# EAGLE schematic beaglebone_basic_v1.12 (EAGLE 5.11)
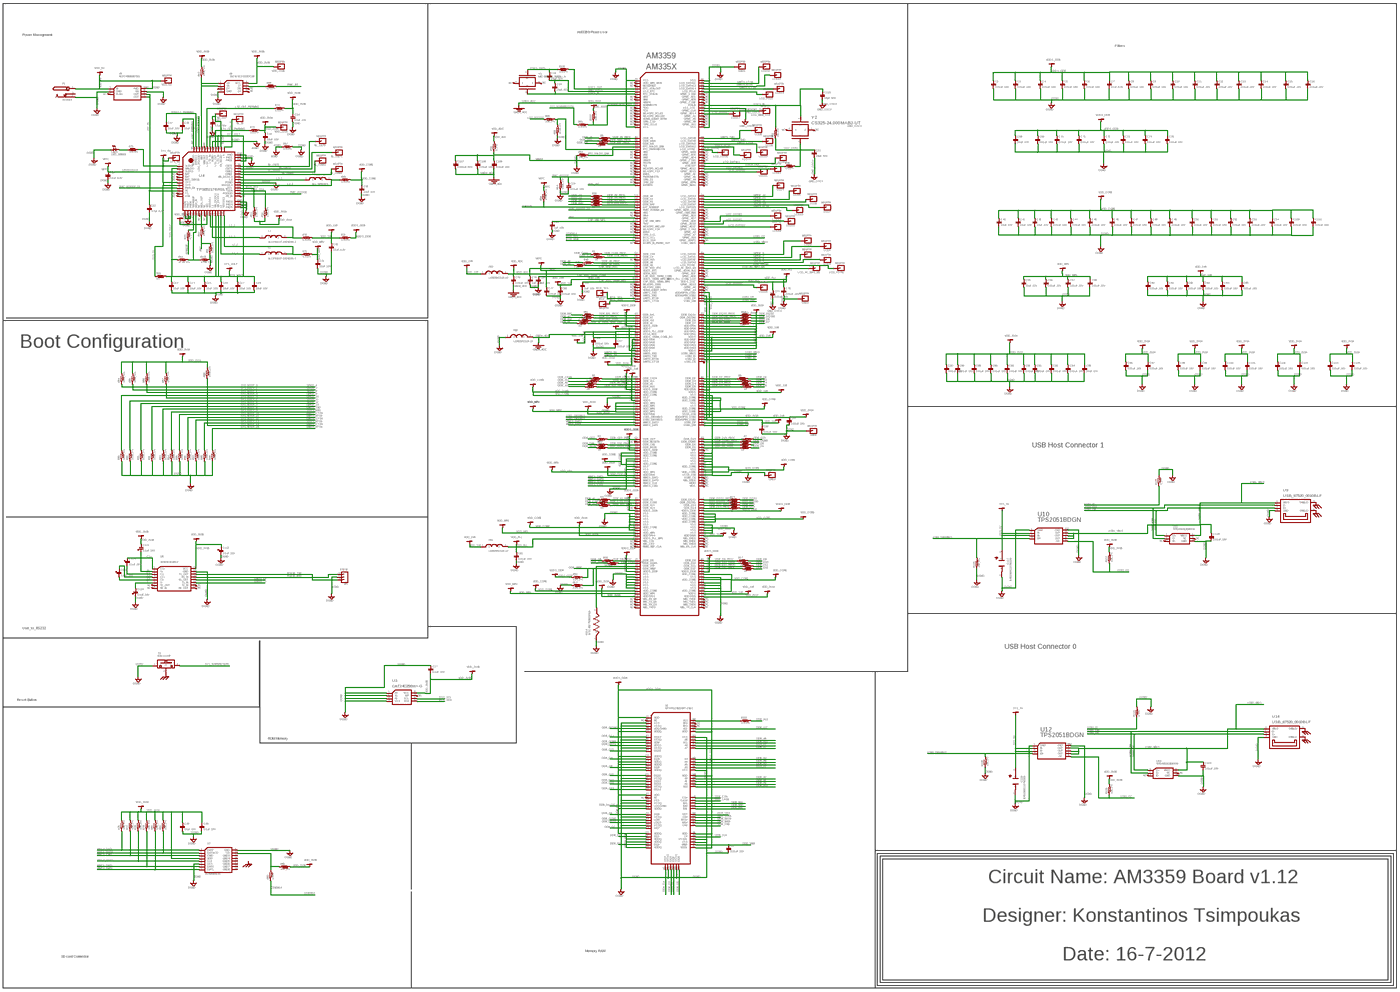
[diagram p0: schematic, sheet 1, overview]
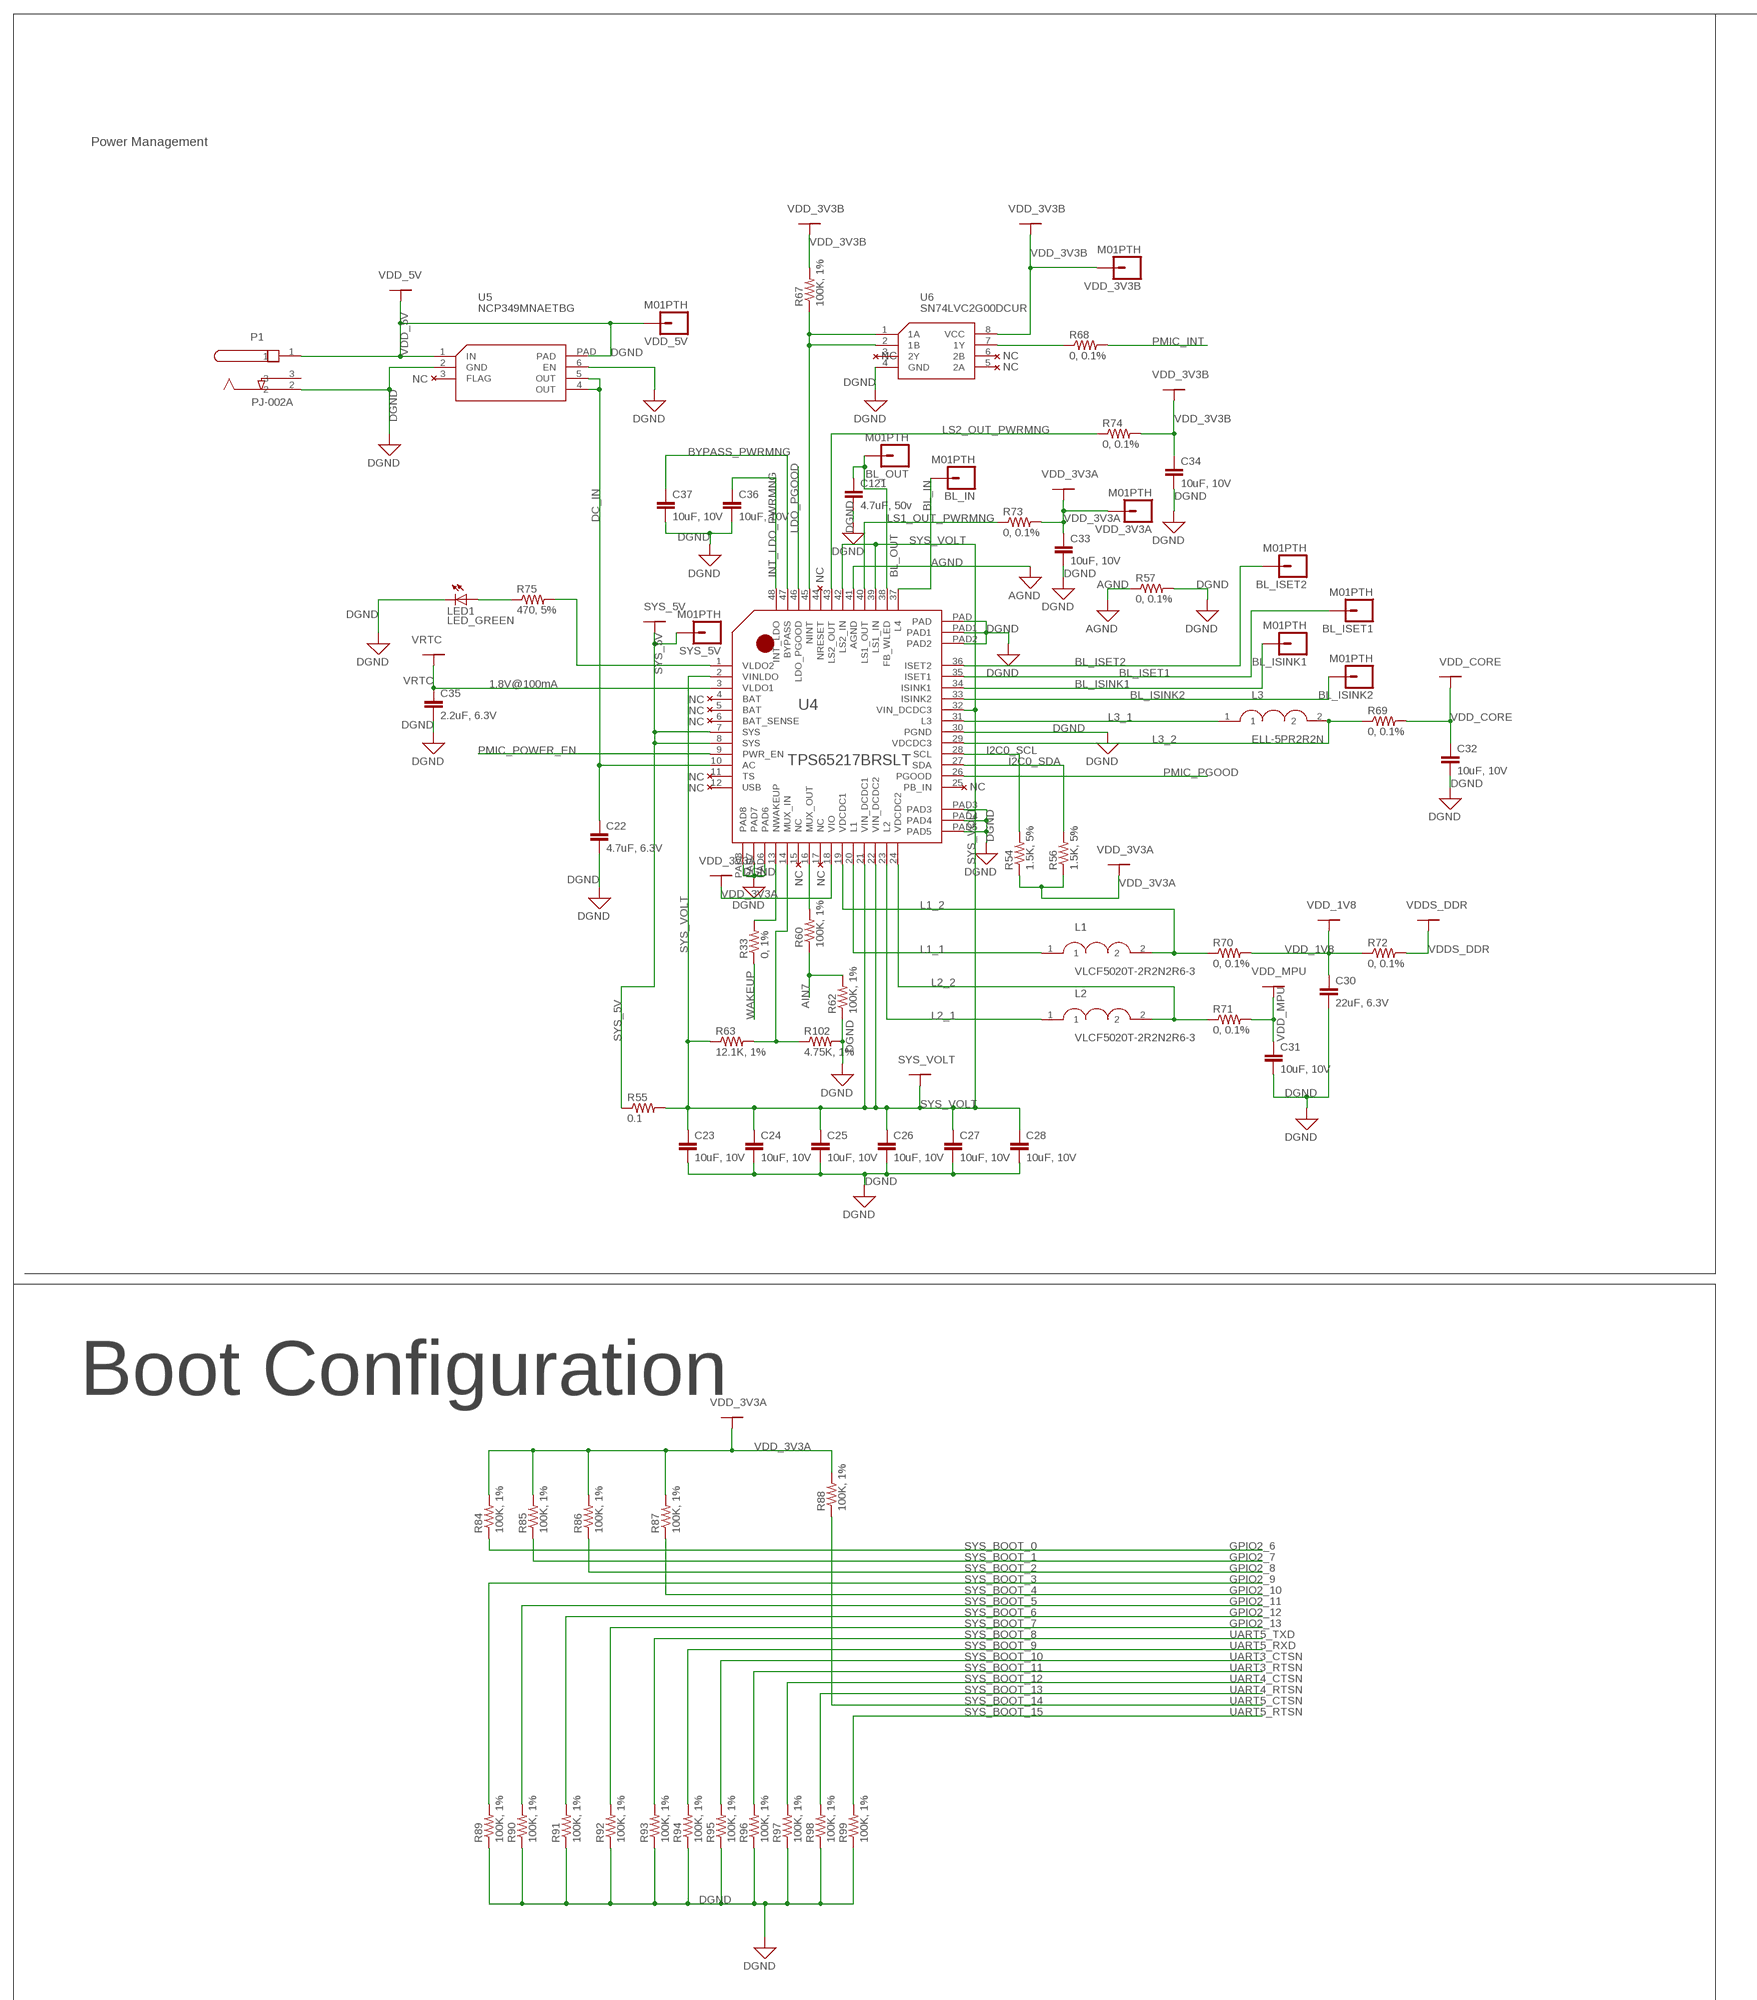
[diagram p1: schematic, sheet 1, part 1 of 6]
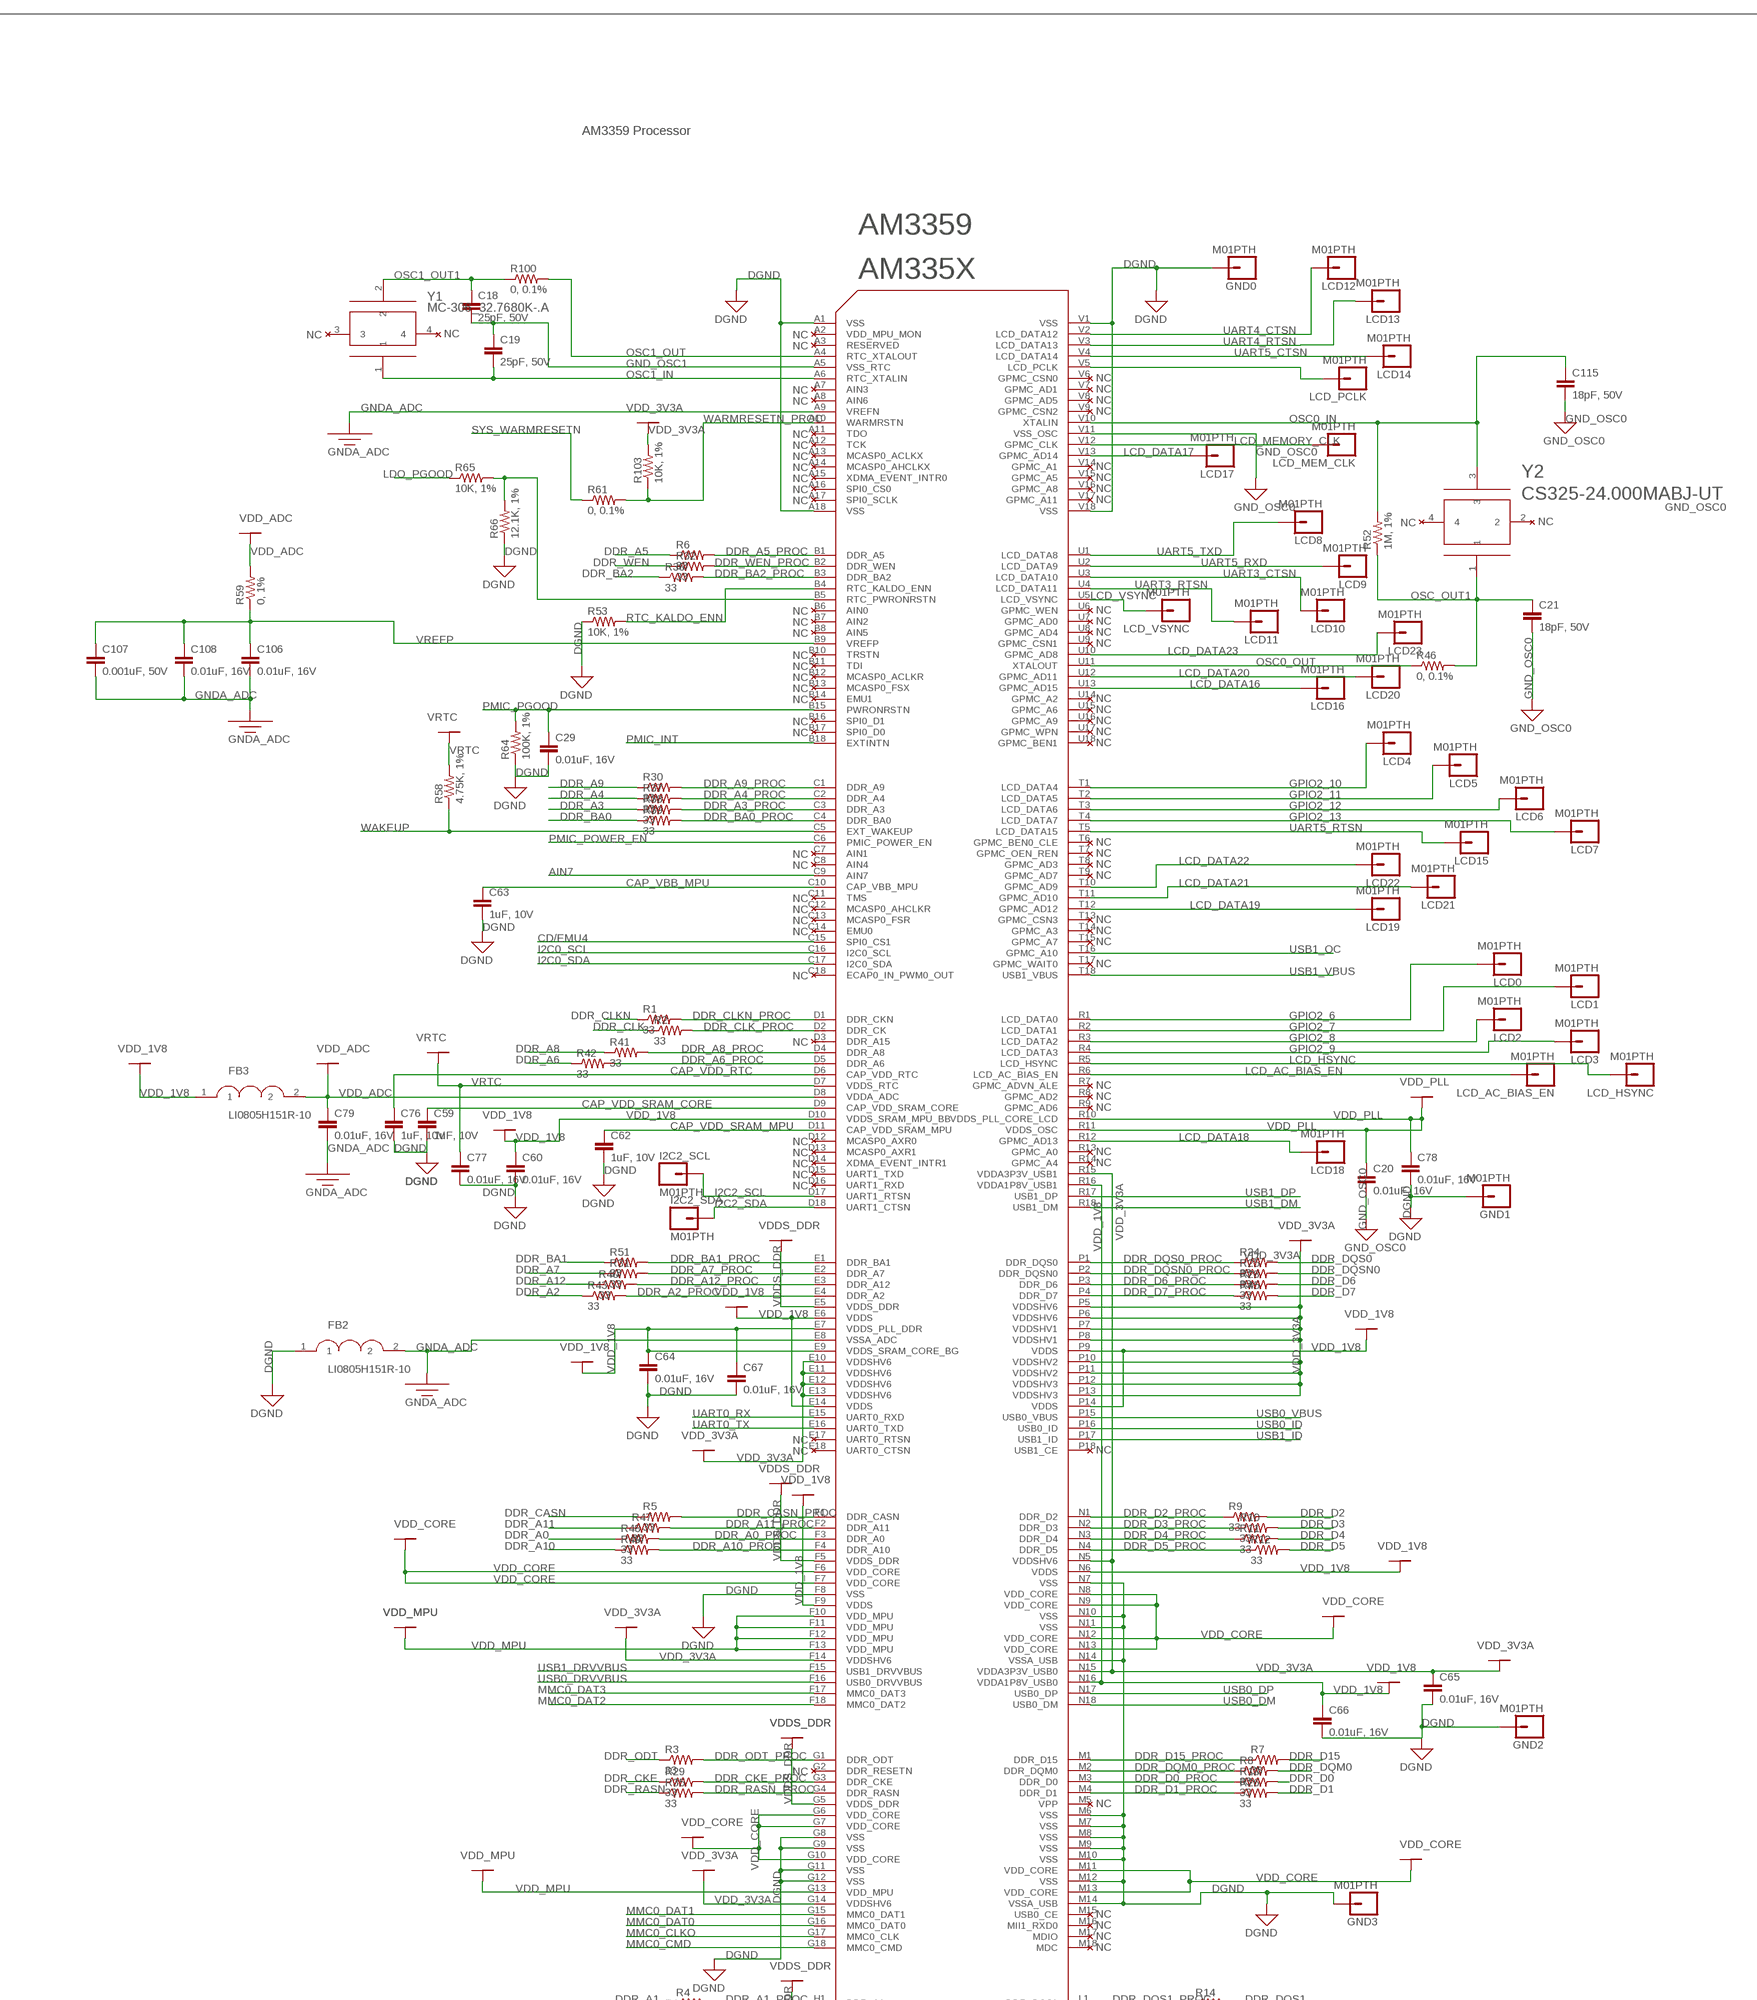
[diagram p2: schematic, sheet 1, part 2 of 6]
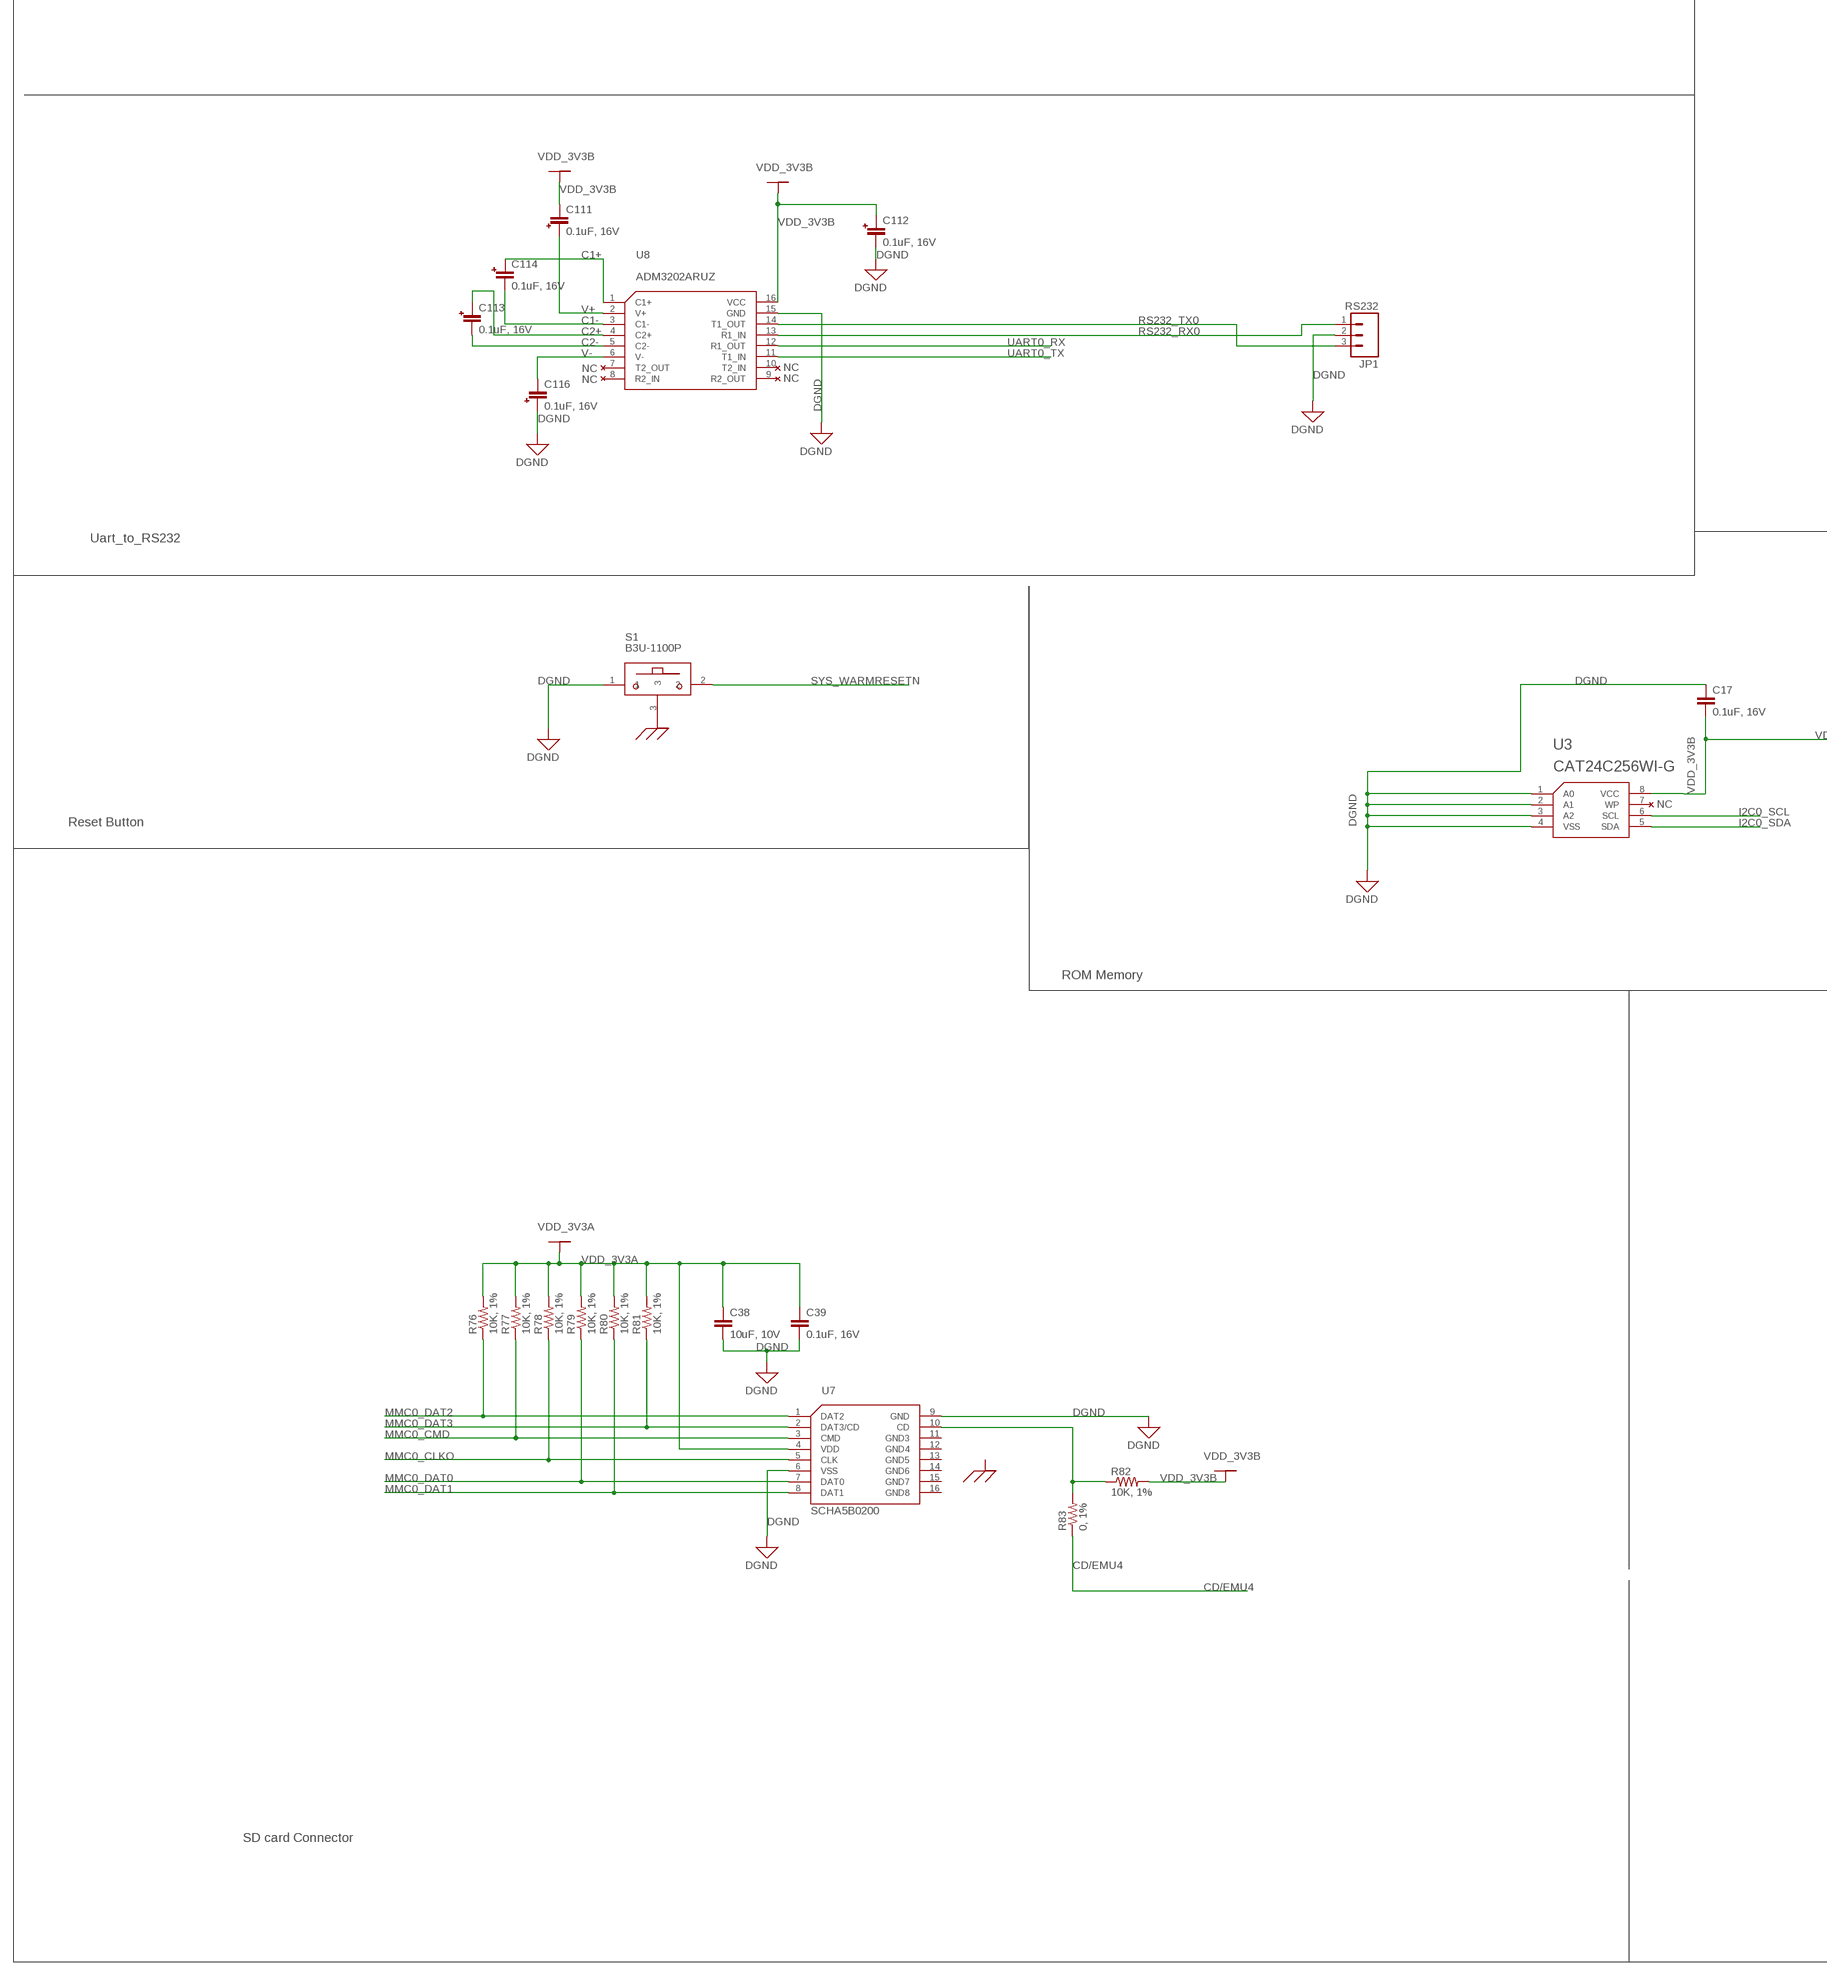
[diagram p3: schematic, sheet 1, part 3 of 6]
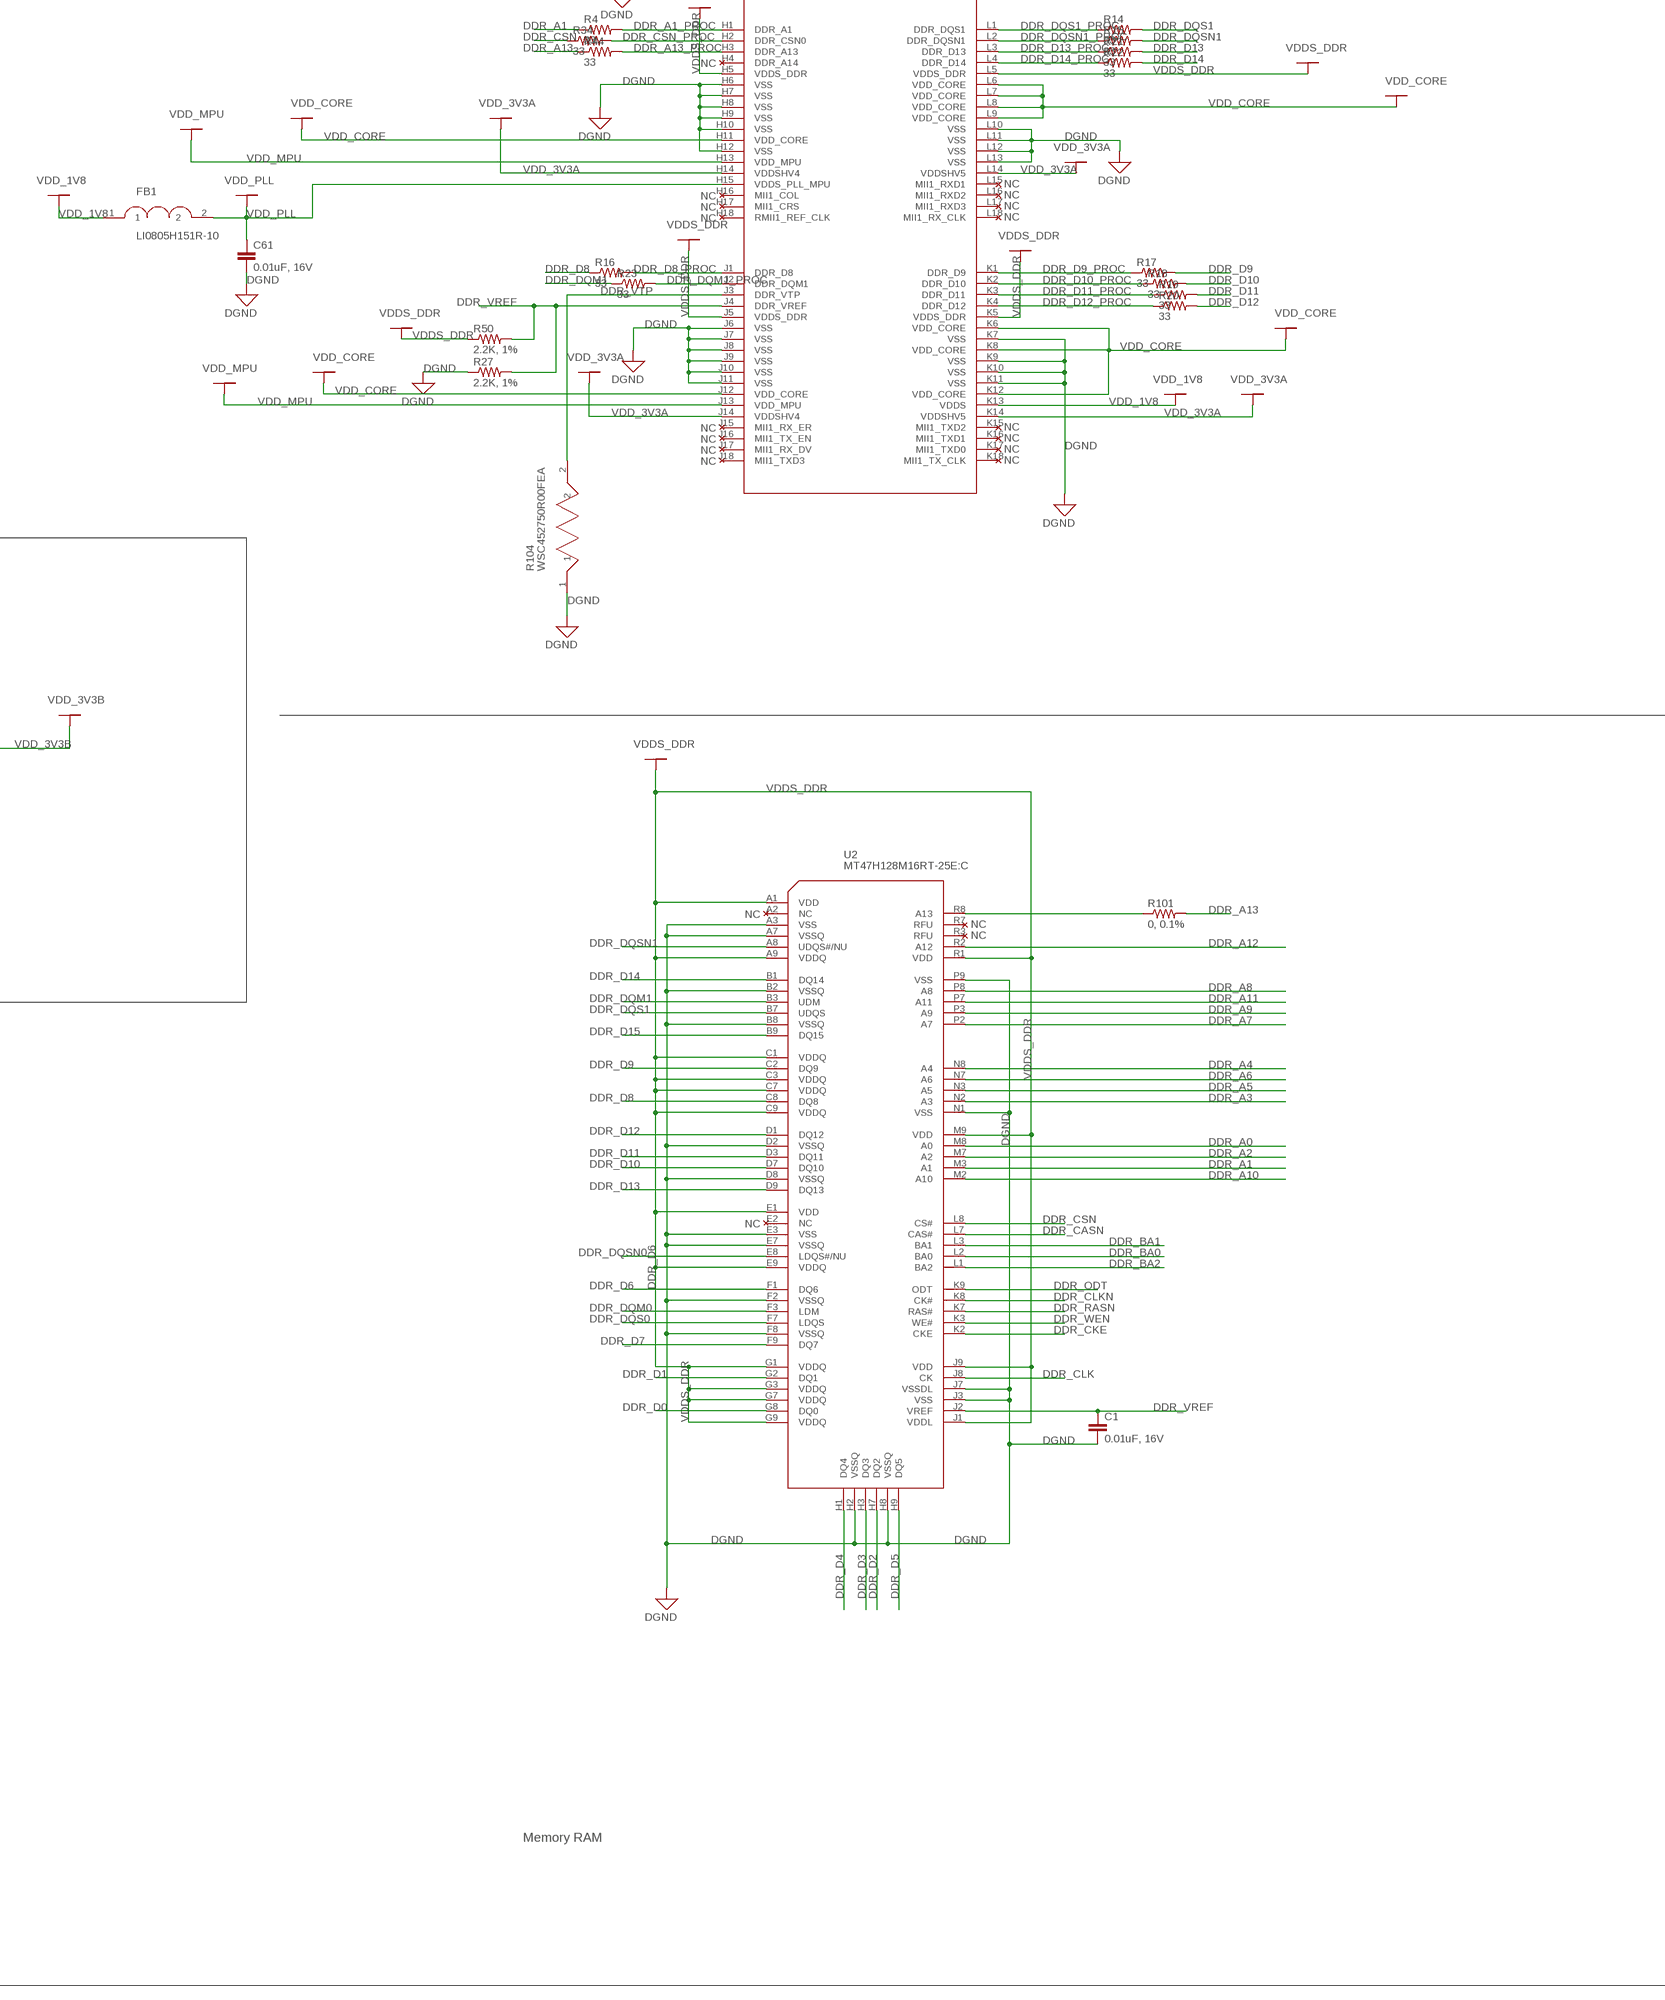
[diagram p4: schematic, sheet 1, part 4 of 6]
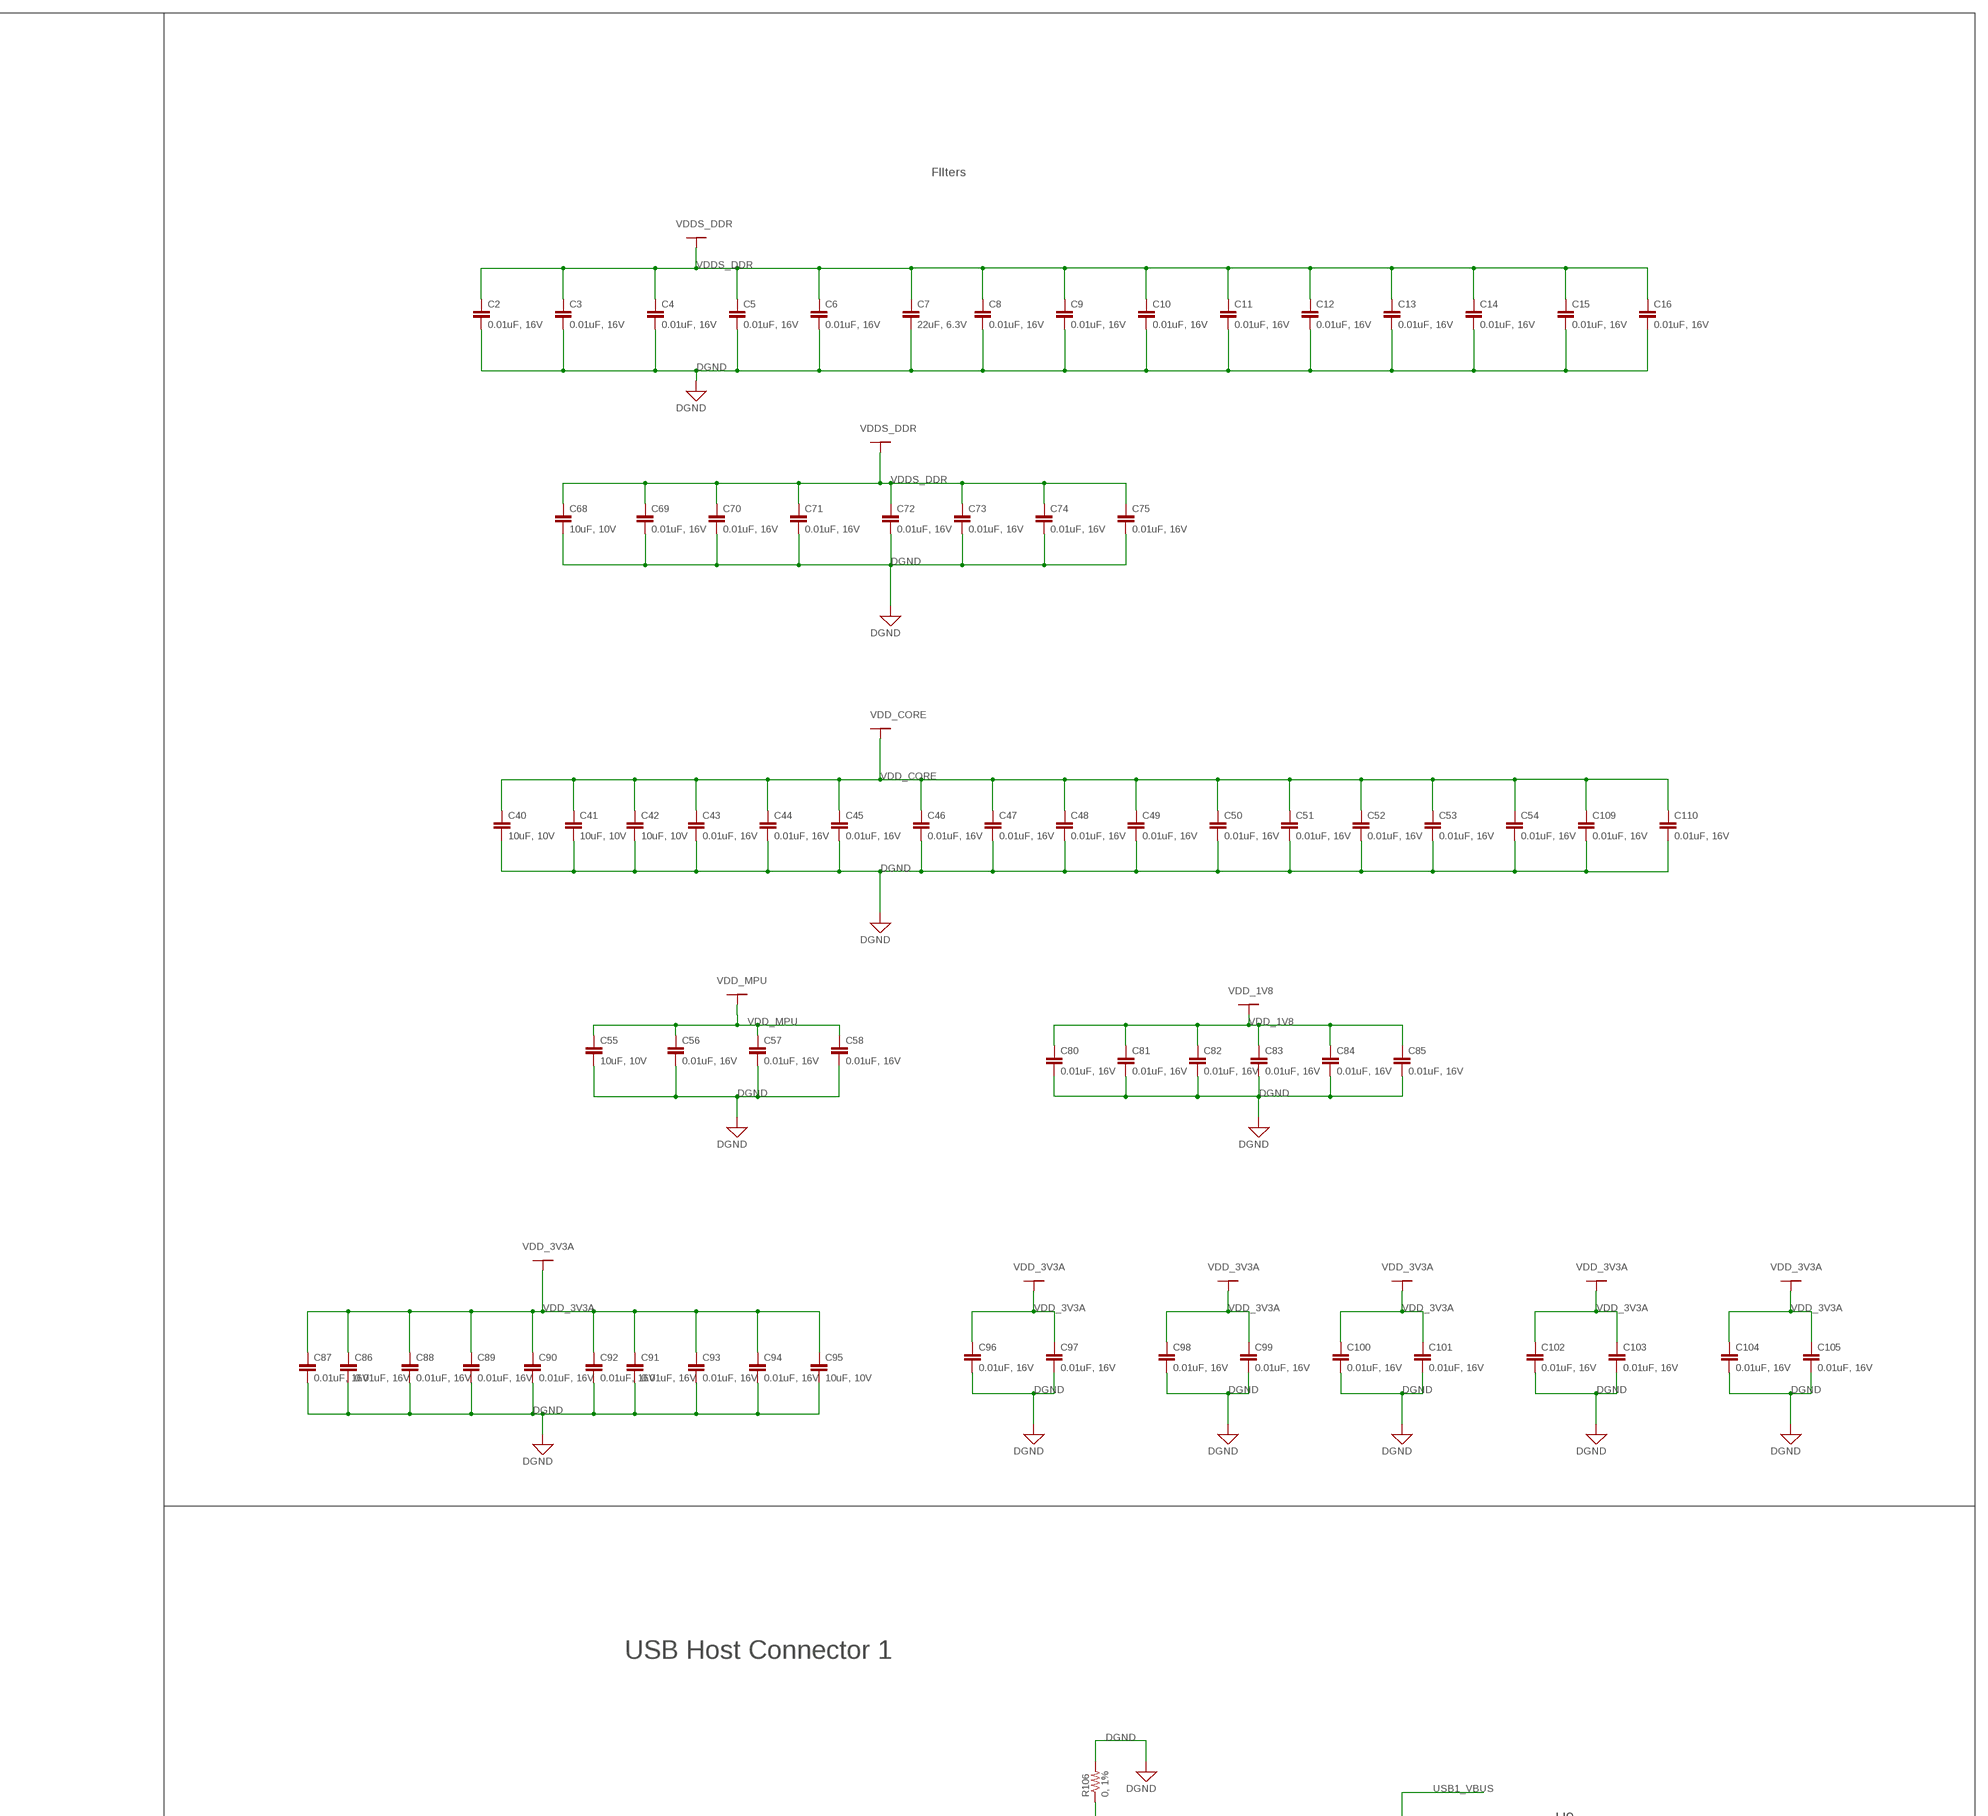
[diagram p5: schematic, sheet 1, part 5 of 6]
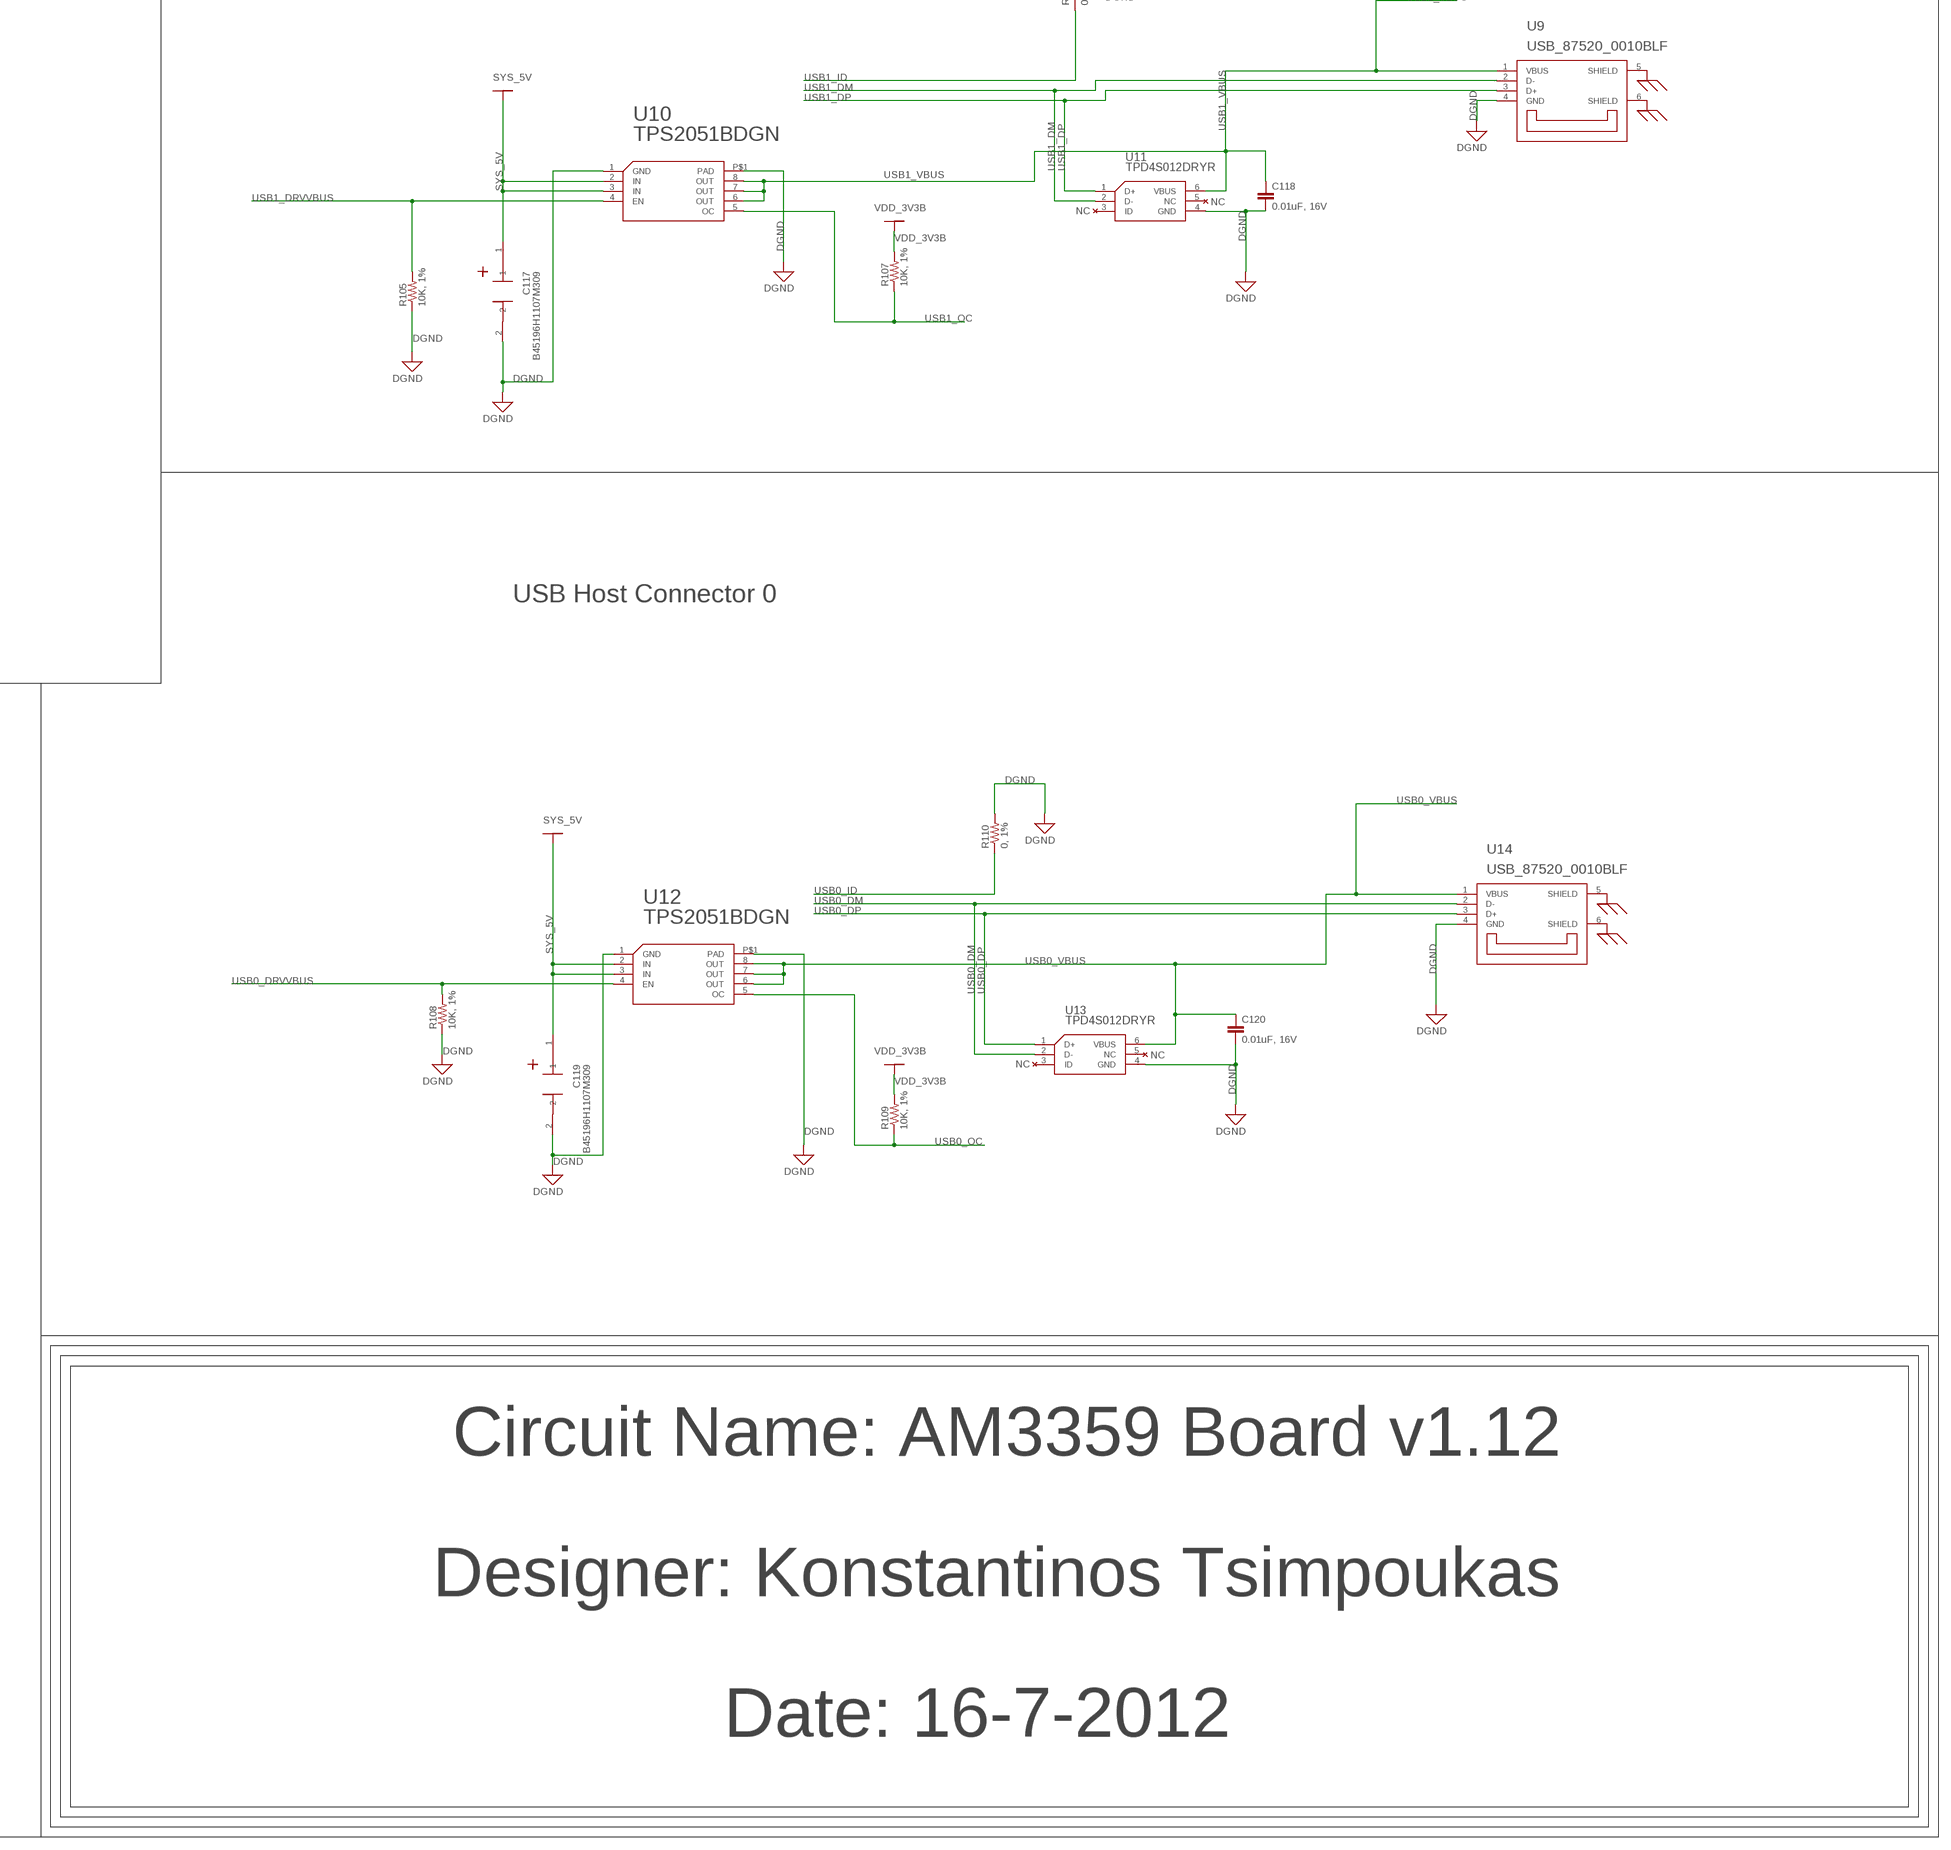
[diagram p6: schematic, sheet 1, part 6 of 6]

## Parts
AM3359  AM335X  [ZCZ(S-PBGA-N324)]
BL_IN  M01PTH  [1X01]
BL_ISET1  M01PTH  [1X01]
BL_ISET2  M01PTH  [1X01]
BL_ISINK1  M01PTH  [1X01]
BL_ISINK2  M01PTH  [1X01]
BL_OUT  M01PTH  [1X01]
C1  0.01uF, 16V  CAP0402-CAP  [0402-CAP]
C2  0.01uF, 16V  CAP0402-CAP  [0402-CAP]
C3  0.01uF, 16V  CAP0402-CAP  [0402-CAP]
C4  0.01uF, 16V  CAP0402-CAP  [0402-CAP]
C5  0.01uF, 16V  CAP0402-CAP  [0402-CAP]
C6  0.01uF, 16V  CAP0402-CAP  [0402-CAP]
C7  22uF, 6.3V  CAP0805  [0805]
C8  0.01uF, 16V  CAP0402-CAP  [0402-CAP]
C9  0.01uF, 16V  CAP0402-CAP  [0402-CAP]
C10  0.01uF, 16V  CAP0402-CAP  [0402-CAP]
C11  0.01uF, 16V  CAP0402-CAP  [0402-CAP]
C12  0.01uF, 16V  CAP0402-CAP  [0402-CAP]
C13  0.01uF, 16V  CAP0402-CAP  [0402-CAP]
C14  0.01uF, 16V  CAP0402-CAP  [0402-CAP]
C15  0.01uF, 16V  CAP0402-CAP  [0402-CAP]
C16  0.01uF, 16V  CAP0402-CAP  [0402-CAP]
C17  0.1uF, 16V  CAP0402-CAP  [0402-CAP]
C18  25pF, 50V  CAP0805  [0805]
C19  25pF, 50V  CAP0805  [0805]
C20  0.01uF, 16V  CAP0402-CAP  [0402-CAP]
C21  18pF, 50V  CAP0805  [0805]
C22  4.7uF, 6.3V  CAP0603-CAP  [0603-CAP]
C23  10uF, 10V  CAP0805  [0805]
C24  10uF, 10V  CAP0805  [0805]
C25  10uF, 10V  CAP0805  [0805]
C26  10uF, 10V  CAP0805  [0805]
C27  10uF, 10V  CAP0805  [0805]
C28  10uF, 10V  CAP0805  [0805]
C29  0.01uF, 16V  CAP0402-CAP  [0402-CAP]
C30  22uF, 6.3V  CAP0805  [0805]
C31  10uF, 10V  CAP0805  [0805]
C32  10uF, 10V  CAP0805  [0805]
C33  10uF, 10V  CAP0805  [0805]
C34  10uF, 10V  CAP0805  [0805]
C35  2.2uF, 6.3V  CAP0402-CAP  [0402-CAP]
C36  10uF, 10V  CAP0805  [0805]
C37  10uF, 10V  CAP0805  [0805]
C38  10uF, 10V  CAP0805  [0805]
C39  0.1uF, 16V  CAP0402-CAP  [0402-CAP]
C40  10uF, 10V  CAP0805  [0805]
C41  10uF, 10V  CAP0805  [0805]
C42  10uF, 10V  CAP0805  [0805]
C43  0.01uF, 16V  CAP0402-CAP  [0402-CAP]
C44  0.01uF, 16V  CAP0402-CAP  [0402-CAP]
C45  0.01uF, 16V  CAP0402-CAP  [0402-CAP]
C46  0.01uF, 16V  CAP0402-CAP  [0402-CAP]
C47  0.01uF, 16V  CAP0402-CAP  [0402-CAP]
C48  0.01uF, 16V  CAP0402-CAP  [0402-CAP]
C49  0.01uF, 16V  CAP0402-CAP  [0402-CAP]
C50  0.01uF, 16V  CAP0402-CAP  [0402-CAP]
C51  0.01uF, 16V  CAP0402-CAP  [0402-CAP]
C52  0.01uF, 16V  CAP0402-CAP  [0402-CAP]
C53  0.01uF, 16V  CAP0402-CAP  [0402-CAP]
C54  0.01uF, 16V  CAP0402-CAP  [0402-CAP]
C55  10uF, 10V  CAP0805  [0805]
C56  0.01uF, 16V  CAP0402-CAP  [0402-CAP]
C57  0.01uF, 16V  CAP0402-CAP  [0402-CAP]
C58  0.01uF, 16V  CAP0402-CAP  [0402-CAP]
C59  1uF, 10V  CAP0805  [0805]
C60  0.01uF, 16V  CAP0402-CAP  [0402-CAP]
C61  0.01uF, 16V  CAP0402-CAP  [0402-CAP]
C62  1uF, 10V  CAP0402-CAP  [0402-CAP]
C63  1uF, 10V  CAP0402-CAP  [0402-CAP]
C64  0.01uF, 16V  CAP0402-CAP  [0402-CAP]
C65  0.01uF, 16V  CAP0402-CAP  [0402-CAP]
C66  0.01uF, 16V  CAP0402-CAP  [0402-CAP]
C67  0.01uF, 16V  CAP0402-CAP  [0402-CAP]
C68  10uF, 10V  CAP0805  [0805]
C69  0.01uF, 16V  CAP0402-CAP  [0402-CAP]
C70  0.01uF, 16V  CAP0402-CAP  [0402-CAP]
C71  0.01uF, 16V  CAP0402-CAP  [0402-CAP]
C72  0.01uF, 16V  CAP0402-CAP  [0402-CAP]
C73  0.01uF, 16V  CAP0402-CAP  [0402-CAP]
C74  0.01uF, 16V  CAP0402-CAP  [0402-CAP]
C75  0.01uF, 16V  CAP0402-CAP  [0402-CAP]
C76  1uF, 10V  CAP0402-CAP  [0402-CAP]
C77  0.01uF, 16V  CAP0805  [0805]
C78  0.01uF, 16V  CAP0402-CAP  [0402-CAP]
C79  0.01uF, 16V  CAP0805  [0805]
C80  0.01uF, 16V  CAP0402-CAP  [0402-CAP]
C81  0.01uF, 16V  CAP0402-CAP  [0402-CAP]
C82  0.01uF, 16V  CAP0402-CAP  [0402-CAP]
C83  0.01uF, 16V  CAP0402-CAP  [0402-CAP]
C84  0.01uF, 16V  CAP0402-CAP  [0402-CAP]
C85  0.01uF, 16V  CAP0402-CAP  [0402-CAP]
C86  0.01uF, 16V  CAP0402-CAP  [0402-CAP]
C87  0.01uF, 16V  CAP0402-CAP  [0402-CAP]
C88  0.01uF, 16V  CAP0402-CAP  [0402-CAP]
C89  0.01uF, 16V  CAP0402-CAP  [0402-CAP]
C90  0.01uF, 16V  CAP0402-CAP  [0402-CAP]
C91  0.01uF, 16V  CAP0402-CAP  [0402-CAP]
C92  0.01uF, 16V  CAP0402-CAP  [0402-CAP]
C93  0.01uF, 16V  CAP0402-CAP  [0402-CAP]
C94  0.01uF, 16V  CAP0402-CAP  [0402-CAP]
C95  10uF, 10V  CAP0805  [0805]
C96  0.01uF, 16V  CAP0402-CAP  [0402-CAP]
C97  0.01uF, 16V  CAP0402-CAP  [0402-CAP]
C98  0.01uF, 16V  CAP0402-CAP  [0402-CAP]
C99  0.01uF, 16V  CAP0402-CAP  [0402-CAP]
C100  0.01uF, 16V  CAP0402-CAP  [0402-CAP]
C101  0.01uF, 16V  CAP0402-CAP  [0402-CAP]
C102  0.01uF, 16V  CAP0402-CAP  [0402-CAP]
C103  0.01uF, 16V  CAP0402-CAP  [0402-CAP]
C104  0.01uF, 16V  CAP0402-CAP  [0402-CAP]
C105  0.01uF, 16V  CAP0402-CAP  [0402-CAP]
C106  0.01uF, 16V  CAP0402-CAP  [0402-CAP]
C107  0.001uF, 50V  CAP0402-CAP  [0402-CAP]
C108  0.01uF, 16V  CAP0402-CAP  [0402-CAP]
C109  0.01uF, 16V  CAP0402-CAP  [0402-CAP]
C110  0.01uF, 16V  CAP0402-CAP  [0402-CAP]
C111  0.1uF, 16V  CAP0805  [0805]
C112  0.1uF, 16V  CAP0805  [0805]
C113  0.1uF, 16V  CAP0805  [0805]
C114  0.1uF, 16V  CAP0805  [0805]
C115  18pF, 50V  CAP0805  [0805]
C116  0.1uF, 16V  CAP0805  [0805]
C117  B45196H1107M309  [B45196H1107M309_PACKAGE]
C118  0.01uF, 16V  CAP0402-CAP  [0402-CAP]
C119  B45196H1107M309  [B45196H1107M309_PACKAGE]
C120  0.01uF, 16V  CAP0402-CAP  [0402-CAP]
C121  4.7uF, 50v  CAP0805  [0805]
FB1  LI0805H151R-10  [LI0805H151R-10_PACKAGE]
FB2  LI0805H151R-10  [LI0805H151R-10_PACKAGE]
FB3  LI0805H151R-10  [LI0805H151R-10_PACKAGE]
GND0  M01PTH  [1X01]
GND1  M01PTH  [1X01]
GND2  M01PTH  [1X01]
GND3  M01PTH  [1X01]
I2C2_SCL  M01PTH  [1X01]
I2C2_SDA  M01PTH  [1X01]
JP1  RS232  M03PTH  [1X03]
L1  VLCF5020T-2R2N2R6-3  [VLCF5020T-2R2N2R6-3]
L2  VLCF5020T-2R2N2R6-3  [VLCF5020T-2R2N2R6-3]
L3  ELL-5PR2R2N  [ELL-5PR2R2N]
LCD0  M01PTH  [1X01]
LCD1  M01PTH  [1X01]
LCD2  M01PTH  [1X01]
LCD3  M01PTH  [1X01]
LCD4  M01PTH  [1X01]
LCD5  M01PTH  [1X01]
LCD6  M01PTH  [1X01]
LCD7  M01PTH  [1X01]
LCD8  M01PTH  [1X01]
LCD9  M01PTH  [1X01]
LCD10  M01PTH  [1X01]
LCD11  M01PTH  [1X01]
LCD12  M01PTH  [1X01]
LCD13  M01PTH  [1X01]
LCD14  M01PTH  [1X01]
LCD15  M01PTH  [1X01]
LCD16  M01PTH  [1X01]
LCD17  M01PTH  [1X01]
LCD18  M01PTH  [1X01]
LCD19  M01PTH  [1X01]
LCD20  M01PTH  [1X01]
LCD21  M01PTH  [1X01]
LCD22  M01PTH  [1X01]
LCD23  M01PTH  [1X01]
LCD_AC_BIAS_EN  M01PTH  [1X01]
LCD_HSYNC  M01PTH  [1X01]
LCD_MEM_CLK  M01PTH  [1X01]
LCD_PCLK  M01PTH  [1X01]
LCD_VSYNC  M01PTH  [1X01]
LED1  LED_GREEN  LEDCHIP-LED0805  [CHIP-LED0805]
P1  PJ-002A  [PJ-002A_PACKAGE]
R1  33  RESISTOR0402-RES  [0402-RES]
R2  33  RESISTOR0402-RES  [0402-RES]
R3  33  RESISTOR0402-RES  [0402-RES]
R4  33  RESISTOR0402-RES  [0402-RES]
R5  33  RESISTOR0402-RES  [0402-RES]
R6  33  RESISTOR0402-RES  [0402-RES]
R7  33  RESISTOR0402-RES  [0402-RES]
R8  33  RESISTOR0402-RES  [0402-RES]
R9  33  RESISTOR0402-RES  [0402-RES]
R10  33  RESISTOR0402-RES  [0402-RES]
R11  33  RESISTOR0402-RES  [0402-RES]
R12  33  RESISTOR0402-RES  [0402-RES]
R13  33  RESISTOR0402-RES  [0402-RES]
R14  33  RESISTOR0402-RES  [0402-RES]
R15  33  RESISTOR0402-RES  [0402-RES]
R16  33  RESISTOR0402-RES  [0402-RES]
R17  33  RESISTOR0402-RES  [0402-RES]
R18  33  RESISTOR0402-RES  [0402-RES]
R19  33  RESISTOR0402-RES  [0402-RES]
R20  33  RESISTOR0402-RES  [0402-RES]
R21  33  RESISTOR0402-RES  [0402-RES]
R22  33  RESISTOR0402-RES  [0402-RES]
R23  33  RESISTOR0402-RES  [0402-RES]
R24  33  RESISTOR0402-RES  [0402-RES]
R25  33  RESISTOR0402-RES  [0402-RES]
R26  33  RESISTOR0402-RES  [0402-RES]
R27  2.2K, 1%  RESISTOR0402-RES  [0402-RES]
R28  33  RESISTOR0402-RES  [0402-RES]
R29  33  RESISTOR0402-RES  [0402-RES]
R30  33  RESISTOR0402-RES  [0402-RES]
R31  33  RESISTOR0402-RES  [0402-RES]
R32  33  RESISTOR0402-RES  [0402-RES]
R33  0, 1%  RESISTOR0402-RES  [0402-RES]
R34  33  RESISTOR0402-RES  [0402-RES]
R35  33  RESISTOR0402-RES  [0402-RES]
R36  33  RESISTOR0402-RES  [0402-RES]
R37  33  RESISTOR0402-RES  [0402-RES]
R38  33  RESISTOR0402-RES  [0402-RES]
R39  33  RESISTOR0402-RES  [0402-RES]
R40  33  RESISTOR0402-RES  [0402-RES]
R41  33  RESISTOR0402-RES  [0402-RES]
R42  33  RESISTOR0402-RES  [0402-RES]
R43  33  RESISTOR0402-RES  [0402-RES]
R44  33  RESISTOR0402-RES  [0402-RES]
R45  33  RESISTOR0402-RES  [0402-RES]
R46  0, 0.1%  RESISTOR0402-RES  [0402-RES]
R47  33  RESISTOR0402-RES  [0402-RES]
R48  33  RESISTOR0402-RES  [0402-RES]
R49  33  RESISTOR0402-RES  [0402-RES]
R50  2.2K, 1%  RESISTOR0402-RES  [0402-RES]
R51  33  RESISTOR0402-RES  [0402-RES]
R52  1M, 1%  RESISTOR0402-RES  [0402-RES]
R53  10K, 1%  RESISTOR0402-RES  [0402-RES]
R54  1.5K, 5%  RESISTOR0402-RES  [0402-RES]
R55  0.1  RESISTOR0805-RES  [0805]
R56  1.5K, 5%  RESISTOR0402-RES  [0402-RES]
R57  0, 0.1%  RESISTOR0402-RES  [0402-RES]
R58  4.75K, 1%  RESISTOR0402-RES  [0402-RES]
R59  0, 1%  RESISTOR0402-RES  [0402-RES]
R60  100K, 1%  RESISTOR0402-RES  [0402-RES]
R61  0, 0.1%  RESISTOR0402-RES  [0402-RES]
R62  100K, 1%  RESISTOR0402-RES  [0402-RES]
R63  12.1K, 1%  RESISTOR0402-RES  [0402-RES]
R64  100K, 1%  RESISTOR0402-RES  [0402-RES]
R65  10K, 1%  RESISTOR0402-RES  [0402-RES]
R66  12.1K, 1%  RESISTOR0402-RES  [0402-RES]
R67  100K, 1%  RESISTOR0402-RES  [0402-RES]
R68  0, 0.1%  RESISTOR0402-RES  [0402-RES]
R69  0, 0.1%  RESISTOR0402-RES  [0402-RES]
R70  0, 0.1%  RESISTOR0402-RES  [0402-RES]
R71  0, 0.1%  RESISTOR0402-RES  [0402-RES]
R72  0, 0.1%  RESISTOR0402-RES  [0402-RES]
R73  0, 0.1%  RESISTOR0402-RES  [0402-RES]
R74  0, 0.1%  RESISTOR0402-RES  [0402-RES]
R75  470, 5%  RESISTOR0402-RES  [0402-RES]
R76  10K, 1%  RESISTOR0402-RES  [0402-RES]
R77  10K, 1%  RESISTOR0402-RES  [0402-RES]
R78  10K, 1%  RESISTOR0402-RES  [0402-RES]
R79  10K, 1%  RESISTOR0402-RES  [0402-RES]
R80  10K, 1%  RESISTOR0402-RES  [0402-RES]
R81  10K, 1%  RESISTOR0402-RES  [0402-RES]
R82  10K, 1%  RESISTOR0402-RES  [0402-RES]
R83  0, 1%  RESISTOR0402-RES  [0402-RES]
R84  100K, 1%  RESISTOR0402-RES  [0402-RES]
R85  100K, 1%  RESISTOR0402-RES  [0402-RES]
R86  100K, 1%  RESISTOR0402-RES  [0402-RES]
R87  100K, 1%  RESISTOR0402-RES  [0402-RES]
R88  100K, 1%  RESISTOR0402-RES  [0402-RES]
R89  100K, 1%  RESISTOR0402-RES  [0402-RES]
R90  100K, 1%  RESISTOR0402-RES  [0402-RES]
R91  100K, 1%  RESISTOR0402-RES  [0402-RES]
R92  100K, 1%  RESISTOR0402-RES  [0402-RES]
R93  100K, 1%  RESISTOR0402-RES  [0402-RES]
R94  100K, 1%  RESISTOR0402-RES  [0402-RES]
R95  100K, 1%  RESISTOR0402-RES  [0402-RES]
R96  100K, 1%  RESISTOR0402-RES  [0402-RES]
R97  100K, 1%  RESISTOR0402-RES  [0402-RES]
R98  100K, 1%  RESISTOR0402-RES  [0402-RES]
R99  100K, 1%  RESISTOR0402-RES  [0402-RES]
R100  0, 0.1%  RESISTOR0402-RES  [0402-RES]
R101  0, 0.1%  RESISTOR0402-RES  [0402-RES]
R102  4.75K, 1%  RESISTOR0402-RES  [0402-RES]
R103  10K, 1%  RESISTOR0402-RES  [0402-RES]
R104  WSC452750R00FEA  [WSC452750R00FEA_PACKAGE]
R105  10K, 1%  RESISTOR0402-RES  [0402-RES]
R106  0, 1%  RESISTOR0402-RES  [0402-RES]
R107  10K, 1%  RESISTOR0402-RES  [0402-RES]
R108  10K, 1%  RESISTOR0402-RES  [0402-RES]
R109  10K, 1%  RESISTOR0402-RES  [0402-RES]
R110  0, 1%  RESISTOR0402-RES  [0402-RES]
S1  B3U-1100P  [B3U-1100P_PACKAGE]
SYS_5V  M01PTH  [1X01]
U2  MT47H128M16RT-25E:C  [FBGA_84_BALL_RAM]
U3  CAT24C256WI-G  [SOIC8_CASE_751BD-01]
U4  TPS65217BRSLT  [RSL(S-PVQFN-N8)]
U5  NCP349MNAETBG  [DFN6]
U6  SN74LVC2G00DCUR  [DCU_8]
U7  SCHA5B0200  [SCHA5B0200_PACKAGE]
U8  ADM3202ARUZ  [ADM3202ARUZ_PACKAGE_TSSOP]
U9  USB_87520_0010BLF  [USB_87520_0010BLF_USB_HOST_PACKAGE]
U10  TPS2051BDGN  [DGN8]
U11  TPD4S012DRYR  [DRY6]
U12  TPS2051BDGN  [DGN8]
U13  TPD4S012DRYR  [DRY6]
U14  USB_87520_0010BLF  [USB_87520_0010BLF_USB_HOST_PACKAGE]
VDD_3V3A  M01PTH  [1X01]
VDD_3V3B  M01PTH  [1X01]
VDD_5V  M01PTH  [1X01]
Y1  MC-306_32.7680K-.A  [MC-306_PACKAGE]
Y2  CS325-24.000MABJ-UT  [CS325_PACKAGE]

## Nets
AGND [GND]: R57.1 U4.41(AGND)
AIN7: AM3359.C9(AIN7) R60.1 R62.2
BL_IN [+3.3V]: BL_IN.1 U4.37(L4)
BL_ISET1 [+3.3V]: BL_ISET1.1 U4.35(ISET1)
BL_ISET2 [+3.3V]: BL_ISET2.1 U4.36(ISET2)
BL_ISINK1 [+3.3V]: BL_ISINK1.1 U4.34(ISINK1)
BL_ISINK2 [+3.3V]: BL_ISINK2.1 U4.33(ISINK2)
BL_OUT [+3.3V]: BL_OUT.1 C121.1 U4.38(FB_WLED)
BYPASS_PWRMNG: C37.1 U4.47(BYPASS)
C1+ [+1.8V]: C114.1 U8.1(C1+)
C1- [+1.8V]: C114.2 U8.3(C1-)
C2+ [+1.8V]: C113.1 U8.4(C2+)
C2- [+1.8V]: C113.2 U8.5(C2-)
CAP_VBB_MPU: AM3359.C10(CAP_VBB_MPU) C63.1
CAP_VDD_RTC: AM3359.D6(CAP_VDD_RTC) C76.1
CAP_VDD_SRAM_CORE: AM3359.D9(CAP_VDD_SRAM_CORE) C59.1
CAP_VDD_SRAM_MPU: AM3359.D11(CAP_VDD_SRAM_MPU) C62.1
CD/EMU4: AM3359.C15(SPI0_CS1) R83.1
CD_SD_CARD: R82.1 R83.2 U7.10(CD)
DC_IN [+5V]: C22.1 U4.10(AC) U5.4(OUT) U5.5(OUT)
DDR_A0: R48.1 U2.M8(A0)
DDR_A0_PROC: AM3359.F3(DDR_A0) R48.2
DDR_A1: R4.1 U2.M3(A1)
DDR_A1_PROC: AM3359.H1(DDR_A1) R4.2
DDR_A2: R43.1 U2.M7(A2)
DDR_A2_PROC: AM3359.E4(DDR_A2) R43.2
DDR_A3: R38.1 U2.N2(A3)
DDR_A3_PROC: AM3359.C3(DDR_A3) R38.2
DDR_A4: R37.1 U2.N8(A4)
DDR_A4_PROC: AM3359.C2(DDR_A4) R37.2
DDR_A5: R6.1 U2.N3(A5)
DDR_A5_PROC: AM3359.B1(DDR_A5) R6.2
DDR_A6: R42.1 U2.N7(A6)
DDR_A6_PROC: AM3359.D5(DDR_A6) R42.2
DDR_A7: R31.1 U2.P2(A7)
DDR_A7_PROC: AM3359.E2(DDR_A7) R31.2
DDR_A8: R41.1 U2.P8(A8)
DDR_A8_PROC: AM3359.D4(DDR_A8) R41.2
DDR_A9: R30.1 U2.P3(A9)
DDR_A9_PROC: AM3359.C1(DDR_A9) R30.2
DDR_A10: R49.1 U2.M2(A10)
DDR_A10_PROC: AM3359.F4(DDR_A10) R49.2
DDR_A11: R47.1 U2.P7(A11)
DDR_A11_PROC: AM3359.F2(DDR_A11) R47.2
DDR_A12: R40.1 U2.R2(A12)
DDR_A12_PROC: AM3359.E3(DDR_A12) R40.2
DDR_A13: R44.1 R101.2
DDR_A13_MEM: R101.1 U2.R8(A13)
DDR_A13_PROC: AM3359.H3(DDR_A13) R44.2
DDR_BA0: R39.1 U2.L2(BA0)
DDR_BA0_PROC: AM3359.C4(DDR_BA0) R39.2
DDR_BA1: R51.1 U2.L3(BA1)
DDR_BA1_PROC: AM3359.E1(DDR_BA1) R51.2
DDR_BA2: R36.1 U2.L1(BA2)
DDR_BA2_PROC: AM3359.B3(DDR_BA2) R36.2
DDR_CASN: R5.1 U2.L7(CAS#)
DDR_CASN_PROC: AM3359.F1(DDR_CASN) R5.2
DDR_CKE: R29.1 U2.K2(CKE)
DDR_CKE_PROC: AM3359.G3(DDR_CKE) R29.2
DDR_CLK: R2.1 U2.J8(CK)
DDR_CLK_PROC: AM3359.D2(DDR_CK) R2.2
DDR_CLKN: R1.1 U2.K8(CK#)
DDR_CLKN_PROC: AM3359.D1(DDR_CKN) R1.2
DDR_CSN: R34.1 U2.L8(CS#)
DDR_CSN_PROC: AM3359.H2(DDR_CSN0) R34.2
DDR_D0: R13.2 U2.G8(DQ0)
DDR_D0_PROC: AM3359.M3(DDR_D0) R13.1
DDR_D1: R26.2 U2.G2(DQ1)
DDR_D1_PROC: AM3359.M4(DDR_D1) R26.1
DDR_D2: R9.2 U2.H7(DQ2)
DDR_D2_PROC: AM3359.N1(DDR_D2) R9.1
DDR_D3: R10.2 U2.H3(DQ3)
DDR_D3_PROC: AM3359.N2(DDR_D3) R10.1
DDR_D4: R11.2 U2.H1(DQ4)
DDR_D4_PROC: AM3359.N3(DDR_D4) R11.1
DDR_D5: R12.2 U2.H9(DQ5)
DDR_D5_PROC: AM3359.N4(DDR_D5) R12.1
DDR_D6: R28.2 U2.F1(DQ6)
DDR_D6_PROC: AM3359.P3(DDR_D6) R28.1
DDR_D7: R45.2 U2.F9(DQ7)
DDR_D7_PROC: AM3359.P4(DDR_D7) R45.1
DDR_D8: R16.1 U2.C8(DQ8)
DDR_D8_PROC: AM3359.J1(DDR_D8) R16.2
DDR_D9: R17.2 U2.C2(DQ9)
DDR_D9_PROC: AM3359.K1(DDR_D9) R17.1
DDR_D10: R18.2 U2.D7(DQ10)
DDR_D10_PROC: AM3359.K2(DDR_D10) R18.1
DDR_D11: R19.2 U2.D3(DQ11)
DDR_D11_PROC: AM3359.K3(DDR_D11) R19.1
DDR_D12: R20.2 U2.D1(DQ12)
DDR_D12_PROC: AM3359.K4(DDR_D12) R20.1
DDR_D13: R21.2 U2.D9(DQ13)
DDR_D13_PROC: AM3359.L3(DDR_D13) R21.1
DDR_D14: R22.2 U2.B1(DQ14)
DDR_D14_PROC: AM3359.L4(DDR_D14) R22.1
DDR_D15: R7.2 U2.B9(DQ15)
DDR_D15_PROC: AM3359.M1(DDR_D15) R7.1
DDR_DQM0: R8.2 U2.F3(LDM)
DDR_DQM0_PROC: AM3359.M2(DDR_DQM0) R8.1
DDR_DQM1: R23.1 U2.B3(UDM)
DDR_DQM1_PROC: AM3359.J2(DDR_DQM1) R23.2
DDR_DQS0: R24.2 U2.F7(LDQS)
DDR_DQS0_PROC: AM3359.P1(DDR_DQS0) R24.1
DDR_DQS1: R14.2 U2.B7(UDQS)
DDR_DQS1_PROC: AM3359.L1(DDR_DQS1) R14.1
DDR_DQSN0: R25.2 U2.E8(LDQS#/NU)
DDR_DQSN0_PROC: AM3359.P2(DDR_DQSN0) R25.1
DDR_DQSN1: R15.2 U2.A8(UDQS#/NU)
DDR_DQSN1_PROC: AM3359.L2(DDR_DQSN1) R15.1
DDR_ODT: R3.1 U2.K9(ODT)
DDR_ODT_PROC: AM3359.G1(DDR_ODT) R3.2
DDR_RASN: R35.1 U2.K7(RAS#)
DDR_RASN_PROC: AM3359.G4(DDR_RASN) R35.2
DDR_VREF [+3.3V]: AM3359.J4(DDR_VREF) C1.1 R27.2 R50.2 U2.J2(VREF)
DDR_VTP [+1.8V]: AM3359.J3(DDR_VTP) R104.2
DDR_WEN: R32.1 U2.K3(WE#)
DDR_WEN_PROC: AM3359.B2(DDR_WEN) R32.2
DGND [GND]: AM3359.A1(VSS) AM3359.A18(VSS) AM3359.F8(VSS) AM3359.G8(VSS) AM3359.G9(VSS) AM3359.G11(VSS) AM3359.G12(VSS) AM3359.H6(VSS) AM3359.H7(VSS) AM3359.H8(VSS) AM3359.H9(VSS) AM3359.H10(VSS) AM3359.H12(VSS) AM3359.J6(VSS) AM3359.J7(VSS) AM3359.J8(VSS) AM3359.J9(VSS) AM3359.J10(VSS) AM3359.J11(VSS) AM3359.K7(VSS) AM3359.K9(VSS) AM3359.K10(VSS) AM3359.K11(VSS) AM3359.L10(VSS) AM3359.L11(VSS) AM3359.L12(VSS) AM3359.L13(VSS) AM3359.M6(VSS) AM3359.M7(VSS) AM3359.M8(VSS) AM3359.M9(VSS) AM3359.M10(VSS) AM3359.M12(VSS) AM3359.M14(VSSA_USB) AM3359.N7(VSS) AM3359.N10(VSS) AM3359.N11(VSS) AM3359.N14(VSSA_USB) AM3359.V1(VSS) AM3359.V18(VSS) C1.2 C2.2 C3.2 C4.2 C5.2 C6.2 C7.2 C8.2 C9.2 C10.2 C11.2 C12.2 C13.2 C14.2 C15.2 C16.2 C17.1 C22.2 C23.2 C24.2 C25.2 C26.2 C27.2 C28.2 C29.2 C30.2 C31.2 C32.2 C33.2 C34.2 C35.2 C36.2 C37.2 C38.2 C39.2 C40.2 C41.2 C42.2 C43.2 C44.2 C45.2 C46.2 C47.2 C48.2 C49.2 C50.2 C51.2 C52.2 C53.2 C54.2 C55.2 C56.2 C57.2 C58.2 C59.2 C60.2 C61.2 C62.2 C63.2 C64.2 C65.2 C66.2 C67.2 C68.2 C69.2 C70.2 C71.2 C72.2 C73.2 C74.2 C75.2 C76.2 C77.2 C78.2 C80.2 C81.2 C82.2 C83.2 C84.2 C85.2 C86.2 C87.2 C88.2 C89.2 C90.2 C91.2 C92.2 C93.2 C94.2 C95.2 C96.2 C97.2 C98.2 C99.2 C100.2 C101.2 C102.2 C103.2 C104.2 C105.2 C109.2 C110.2 C112.2 C116.2 C117.2 C118.2 C119.2 C120.2 C121.2 FB2.1 GND0.1 GND1.1 GND2.1 GND3.1 JP1.2 LED1.C P1.2 R27.1 R53.1 R57.2 R62.1 R64.1 R66.1 R89.1 R90.1 R91.1 R92.1 R93.1 R94.1 R95.1 R96.1 R97.1 R98.1 R99.1 R102.2 R104.1 R105.1 R106.2 R108.1 R110.2 S1.1 U2.A3(VSS) U2.A7(VSSQ) U2.B2(VSSQ) U2.B8(VSSQ) U2.D2(VSSQ) U2.D8(VSSQ) U2.E3(VSS) U2.E7(VSSQ) U2.F2(VSSQ) U2.F8(VSSQ) U2.H2(VSSQ) U2.H8(VSSQ) U2.J3(VSS) U2.J7(VSSDL) U2.N1(VSS) U2.P9(VSS) U3.1(A0) U3.2(A1) U3.3(A2) U3.4(VSS) U4.30(PGND) U4.PAD U4.PAD1 U4.PAD2 U4.PAD3 U4.PAD4 U4.PAD5 U4.PAD6 U4.PAD7 U4.PAD8 U5.2(GND) U5.6(EN) U6.4(GND) U7.6(VSS) U7.9(GND) U8.15(GND) U9.4(GND) U10.1(GND) U10.P$1(PAD) U11.4(GND) U12.1(GND) U12.P$1(PAD) U13.4(GND) U14.4(GND)
GND_OSC0 [GND]: AM3359.V11(VSS_OSC) C20.2 C21.2 C115.2
GND_OSC1 [+1.8V]: AM3359.A5(VSS_RTC) C18.2 C19.1
GNDA_ADC [GND]: AM3359.A9(VREFN) AM3359.E8(VSSA_ADC) C79.2 C106.2 C107.2 C108.2 FB2.2
GPIO2_6: AM3359.R1(LCD_DATA0) LCD0.1 R84.1
GPIO2_7: AM3359.R2(LCD_DATA1) LCD1.1 R85.1
GPIO2_8: AM3359.R3(LCD_DATA2) LCD2.1 R86.1
GPIO2_9: AM3359.R4(LCD_DATA3) LCD3.1 R89.2
GPIO2_10: AM3359.T1(LCD_DATA4) LCD4.1 R87.1
GPIO2_11: AM3359.T2(LCD_DATA5) LCD5.1 R90.2
GPIO2_12: AM3359.T3(LCD_DATA6) LCD6.1 R91.2
GPIO2_13: AM3359.T4(LCD_DATA7) LCD7.1 R92.2
I2C0_SCL: AM3359.C16(I2C0_SCL) R54.2 U3.6(SCL) U4.28(SCL)
I2C0_SDA: AM3359.C17(I2C0_SDA) R56.2 U3.5(SDA) U4.27(SDA)
I2C2_SCL: AM3359.D17(UART1_RTSN) I2C2_SCL.1
I2C2_SDA: AM3359.D18(UART1_CTSN) I2C2_SDA.1
INT_LDO_PWRMNG: C36.1 U4.48(INT_LDO)
L1_1 [+1.8V]: L1.1 U4.20(L1)
L1_2 [+1.8V]: L1.2 R70.1 U4.19(VDCDC1)
L2_1 [+1.8V]: L2.1 U4.23(L2)
L2_2 [+1.8V]: L2.2 R71.1 U4.24(VDCDC2)
L3_1 [+1.8V]: L3.1 U4.31(L3)
L3_2 [+1.8V]: L3.2 R69.1 U4.29(VDCDC3)
LCD_AC_BIAS_EN: AM3359.R6(LCD_AC_BIAS_EN) LCD_AC_BIAS_EN.1
LCD_DATA16: AM3359.U13(GPMC_AD15) LCD16.1
LCD_DATA17: AM3359.V13(GPMC_AD14) LCD17.1
LCD_DATA18: AM3359.R12(GPMC_AD13) LCD18.1
LCD_DATA19: AM3359.T12(GPMC_AD12) LCD19.1
LCD_DATA20: AM3359.U12(GPMC_AD11) LCD20.1
LCD_DATA21: AM3359.T11(GPMC_AD10) LCD21.1
LCD_DATA22: AM3359.T10(GPMC_AD9) LCD22.1
LCD_DATA23: AM3359.U10(GPMC_AD8) LCD23.1
LCD_HSYNC: AM3359.R5(LCD_HSYNC) LCD_HSYNC.1
LCD_MEMORY_CLK: AM3359.V12(GPMC_CLK) LCD_MEM_CLK.1
LCD_PCLK: AM3359.V5(LCD_PCLK) LCD_PCLK.1
LCD_VSYNC: AM3359.U5(LCD_VSYNC) LCD_VSYNC.1
LDO_PGOOD: R65.1 U4.46(LDO_PGOOD)
LS1_OUT_PWRMNG [+5V]: R73.1 U4.40(LS1_OUT)
LS2_OUT_PWRMNG [+3.3V]: R74.1 U4.43(LS2_OUT)
MMC0_CLKO: AM3359.G17(MMC0_CLK) R78.1 U7.5(CLK)
MMC0_CMD: AM3359.G18(MMC0_CMD) R77.1 U7.3(CMD)
MMC0_DAT0: AM3359.G16(MMC0_DAT0) R79.1 U7.7(DAT0)
MMC0_DAT1: AM3359.G15(MMC0_DAT1) R80.1 U7.8(DAT1)
MMC0_DAT2: AM3359.F18(MMC0_DAT2) R76.1 U7.1(DAT2)
MMC0_DAT3: AM3359.F17(MMC0_DAT3) R81.1 U7.2(DAT3/CD)
MUX_IN_PWRMNG [+1.8V]: R63.2 R102.1 U4.14(MUX_IN)
MUX_OUT_PWRMNG: R60.2 U4.16(MUX_OUT)
NAND_OUTPUT: R68.1 U6.7(1Y)
NINT_PWRMNG [+3.3V]: R67.1 U4.45(NINT) U6.1(1A) U6.2(1B)
OSC0_IN [+1.8V]: AM3359.V10(XTALIN) C115.1 R52.2 Y2.3
OSC0_OUT [+1.8V]: AM3359.U11(XTALOUT) R46.1
OSC1_IN [+1.8V]: AM3359.A6(RTC_XTALIN) C19.2 Y1.1
OSC1_OUT [+1.8V]: AM3359.A4(RTC_XTALOUT) R100.2
OSC1_OUT1 [+1.8V]: C18.1 R100.1 Y1.2
OSC_OUT1 [+1.8V]: C21.1 R46.2 R52.1 Y2.1
PMIC_INT: AM3359.B18(EXTINTN) R68.2
PMIC_PGOOD: AM3359.B15(PWRONRSTN) C29.1 R64.2 U4.26(PGOOD)
PMIC_POWER_EN: AM3359.C6(PMIC_POWER_EN) U4.9(PWR_EN)
PWR_LED [+1.8V]: R75.2 U4.1(VLDO2)
PWR_LEDR [+1.8V]: LED1.A R75.1
RS232_RX0: JP1.1 U8.13(R1_IN)
RS232_TX0: JP1.3 U8.14(T1_OUT)
RTC_KALDO_ENN: AM3359.B4(RTC_KALDO_ENN) R53.2
RTC_PORZ: AM3359.B5(RTC_PWRONRSTN) R65.2 R66.2
SYS_5V [+5V]: C117.1 C119.1 R55.1 SYS_5V.1 U4.7(SYS) U4.8(SYS) U10.2(IN) U10.3(IN) U12.2(IN) U12.3(IN)
SYS_VOLT [+5V]: C23.1 C24.1 C25.1 C26.1 C27.1 C28.1 R55.2 R63.1 U4.2(VINLDO) U4.21(VIN_DCDC1) U4.22(VIN_DCDC2) U4.32(VIN_DCDC3) U4.39(LS1_IN) U4.42(LS2_IN)
SYS_WARMRESETN: R61.1 S1.2
UART0_RX: AM3359.E15(UART0_RXD) U8.12(R1_OUT)
UART0_TX: AM3359.E16(UART0_TXD) U8.11(T1_IN)
UART3_CTSN: AM3359.U3(LCD_DATA10) LCD10.1 R95.2
UART3_RTSN: AM3359.U4(LCD_DATA11) LCD11.1 R96.2
UART4_CTSN: AM3359.V2(LCD_DATA12) LCD12.1 R97.2
UART4_RTSN: AM3359.V3(LCD_DATA13) LCD13.1 R98.2
UART5_CTSN: AM3359.V4(LCD_DATA14) LCD14.1 R88.1
UART5_RTSN: AM3359.T5(LCD_DATA15) LCD15.1 R99.2
UART5_RXD: AM3359.U2(LCD_DATA9) LCD9.1 R94.2
UART5_TXD: AM3359.U1(LCD_DATA8) LCD8.1 R93.2
USB0_DM: AM3359.N18(USB0_DM) U13.2(D-) U14.2(D-)
USB0_DP: AM3359.N17(USB0_DP) U13.1(D+) U14.3(D+)
USB0_DRVVBUS: AM3359.F16(USB0_DRVVBUS) R108.2 U12.4(EN)
USB0_ID: AM3359.P16(USB0_ID) R110.1
USB0_OC: R109.1 U12.5(OC)
USB0_VBUS: AM3359.P15(USB0_VBUS) C120.1 U12.6(OUT) U12.7(OUT) U12.8(OUT) U13.6(VBUS) U14.1(VBUS)
USB1_DM: AM3359.R18(USB1_DM) U9.2(D-) U11.2(D-)
USB1_DP: AM3359.R17(USB1_DP) U9.3(D+) U11.1(D+)
USB1_DRVVBUS: AM3359.F15(USB1_DRVVBUS) R105.2 U10.4(EN)
USB1_ID: AM3359.P17(USB1_ID) R106.1
USB1_OC: AM3359.T16(GPMC_A10) R107.1 U10.5(OC)
USB1_VBUS: AM3359.T18(USB1_VBUS) C118.1 U9.1(VBUS) U10.6(OUT) U10.7(OUT) U10.8(OUT) U11.6(VBUS)
V+ [+3.3V]: C111.2 U8.2(V+)
V- [+3.3V]: C116.1 U8.6(V-)
VDD_1V8 [+1.8V]: AM3359.D10(VDDS_SRAM_MPU_BB) AM3359.E6(VDDS) AM3359.E7(VDDS_PLL_DDR) AM3359.E9(VDDS_SRAM_CORE_BG) AM3359.E14(VDDS) AM3359.F9(VDDS) AM3359.K13(VDDS) AM3359.N6(VDDS) AM3359.N16(VDDA1P8V_USB0) AM3359.P9(VDDS) AM3359.P14(VDDS) AM3359.R16(VDDA1P8V_USB1) C30.1 C60.1 C64.1 C66.1 C67.1 C80.1 C81.1 C82.1 C83.1 C84.1 C85.1 FB1.1 FB3.1 R70.2 R72.1
VDD_3V3A [+3.3V]: AM3359.E10(VDDSHV6) AM3359.E11(VDDSHV6) AM3359.E12(VDDSHV6) AM3359.E13(VDDSHV6) AM3359.F14(VDDSHV6) AM3359.G14(VDDSHV6) AM3359.H14(VDDSHV4) AM3359.J14(VDDSHV4) AM3359.K14(VDDSHV5) AM3359.L14(VDDSHV5) AM3359.N5(VDDSHV6) AM3359.N15(VDDA3P3V_USB0) AM3359.P5(VDDSHV6) AM3359.P6(VDDSHV6) AM3359.P7(VDDSHV1) AM3359.P8(VDDSHV1) AM3359.P10(VDDSHV2) AM3359.P11(VDDSHV2) AM3359.P12(VDDSHV3) AM3359.P13(VDDSHV3) AM3359.R15(VDDA3P3V_USB1) C33.1 C38.1 C39.1 C65.1 C86.1 C87.1 C88.1 C89.1 C90.1 C91.1 C92.1 C93.1 C94.1 C95.1 C96.1 C97.1 C98.1 C99.1 C100.1 C101.1 C102.1 C103.1 C104.1 C105.1 R54.1 R56.1 R73.2 R76.2 R77.2 R78.2 R79.2 R80.2 R81.2 R84.2 R85.2 R86.2 R87.2 R88.2 R103.2 U4.18(VIO) U7.4(VDD) VDD_3V3A.1
VDD_3V3B [+3.3V]: C17.2 C34.1 C111.1 C112.1 R67.2 R74.2 R82.2 R107.2 R109.2 U3.8(VCC) U6.8(VCC) U8.16(VCC) VDD_3V3B.1
VDD_5V [+5V]: P1.1 U5.1(IN) U5.PAD VDD_5V.1
VDD_ADC [+1.8V]: AM3359.D8(VDDA_ADC) C79.1 FB3.2 R59.2
VDD_CORE [+1.1V]: AM3359.F6(VDD_CORE) AM3359.F7(VDD_CORE) AM3359.G6(VDD_CORE) AM3359.G7(VDD_CORE) AM3359.G10(VDD_CORE) AM3359.H11(VDD_CORE) AM3359.J12(VDD_CORE) AM3359.K6(VDD_CORE) AM3359.K8(VDD_CORE) AM3359.K12(VDD_CORE) AM3359.L6(VDD_CORE) AM3359.L7(VDD_CORE) AM3359.L8(VDD_CORE) AM3359.L9(VDD_CORE) AM3359.M11(VDD_CORE) AM3359.M13(VDD_CORE) AM3359.N8(VDD_CORE) AM3359.N9(VDD_CORE) AM3359.N12(VDD_CORE) AM3359.N13(VDD_CORE) C32.1 C40.1 C41.1 C42.1 C43.1 C44.1 C45.1 C46.1 C47.1 C48.1 C49.1 C50.1 C51.1 C52.1 C53.1 C54.1 C109.1 C110.1 R69.2
VDD_MPU [+1.3V]: AM3359.F10(VDD_MPU) AM3359.F11(VDD_MPU) AM3359.F12(VDD_MPU) AM3359.F13(VDD_MPU) AM3359.G13(VDD_MPU) AM3359.H13(VDD_MPU) AM3359.J13(VDD_MPU) C31.1 C55.1 C56.1 C57.1 C58.1 R71.2
VDD_PLL [+1.8V]: AM3359.H15(VDDS_PLL_MPU) AM3359.R10(VDDS_PLL_CORE_LCD) AM3359.R11(VDDS_OSC) C20.1 C61.1 C78.1 FB1.2
VDDS_DDR [+1.8V]: AM3359.E5(VDDS_DDR) AM3359.F5(VDDS_DDR) AM3359.G5(VDDS_DDR) AM3359.H5(VDDS_DDR) AM3359.J5(VDDS_DDR) AM3359.K5(VDDS_DDR) AM3359.L5(VDDS_DDR) C2.1 C3.1 C4.1 C5.1 C6.1 C7.1 C8.1 C9.1 C10.1 C11.1 C12.1 C13.1 C14.1 C15.1 C16.1 C68.1 C69.1 C70.1 C71.1 C72.1 C73.1 C74.1 C75.1 R50.1 R72.2 U2.A1(VDD) U2.A9(VDDQ) U2.C1(VDDQ) U2.C3(VDDQ) U2.C7(VDDQ) U2.C9(VDDQ) U2.E1(VDD) U2.E9(VDDQ) U2.G1(VDDQ) U2.G3(VDDQ) U2.G7(VDDQ) U2.G9(VDDQ) U2.J1(VDDL) U2.J9(VDD) U2.M9(VDD) U2.R1(VDD)
VREFP [+1.8V]: AM3359.B9(VREFP) C106.1 C107.1 C108.1 R59.1
VRTC [+1.8V]: AM3359.D7(VDDS_RTC) C35.1 C77.1 R58.2 U4.3(VLDO1)
WAKEUP: AM3359.C5(EXT_WAKEUP) R33.1 R58.1
WAKEUP_PWRMNG: R33.2 U4.13(NWAKEUP)
WARMRESETN_PROC: AM3359.A10(WARMRSTN) R61.2 R103.1
Unconnected: AM3359.A2(VDD_MPU_MON) AM3359.A3(RESERVED) AM3359.A7(AIN3) AM3359.A8(AIN6) AM3359.A11(TDO) AM3359.A12(TCK) AM3359.A13(MCASP0_ACLKX) AM3359.A14(MCASP0_AHCLKX) AM3359.A15(XDMA_EVENT_INTR0) AM3359.A16(SPI0_CS0) AM3359.A17(SPI0_SCLK) AM3359.B6(AIN0) AM3359.B7(AIN2) AM3359.B8(AIN5) AM3359.B10(TRSTN) AM3359.B11(TDI) AM3359.B12(MCASP0_ACLKR) AM3359.B13(MCASP0_FSX) AM3359.B14(EMU1) AM3359.B16(SPI0_D1) AM3359.B17(SPI0_D0) AM3359.C7(AIN1) AM3359.C8(AIN4) AM3359.C11(TMS) AM3359.C12(MCASP0_AHCLKR) AM3359.C13(MCASP0_FSR) AM3359.C14(EMU0) AM3359.C18(ECAP0_IN_PWM0_OUT) AM3359.D3(DDR_A15) AM3359.D12(MCASP0_AXR0) AM3359.D13(MCASP0_AXR1) AM3359.D14(XDMA_EVENT_INTR1) AM3359.D15(UART1_TXD) AM3359.D16(UART1_RXD) AM3359.E17(UART0_RTSN) AM3359.E18(UART0_CTSN) AM3359.G2(DDR_RESETN) AM3359.H4(DDR_A14) AM3359.H16(MII1_COL) AM3359.H17(MII1_CRS) AM3359.H18(RMII1_REF_CLK) AM3359.J15(MII1_RX_ER) AM3359.J16(MII1_TX_EN) AM3359.J17(MII1_RX_DV) AM3359.J18(MII1_TXD3) AM3359.K15(MII1_TXD2) AM3359.K16(MII1_TXD1) AM3359.K17(MII1_TXD0) AM3359.K18(MII1_TX_CLK) AM3359.L15(MII1_RXD1) AM3359.L16(MII1_RXD2) AM3359.L17(MII1_RXD3) AM3359.L18(MII1_RX_CLK) AM3359.M5(VPP) AM3359.M15(USB0_CE) AM3359.M16(MII1_RXD0) AM3359.M17(MDIO) AM3359.M18(MDC) AM3359.P18(USB1_CE) AM3359.R7(GPMC_ADVN_ALE) AM3359.R8(GPMC_AD2) AM3359.R9(GPMC_AD6) AM3359.R13(GPMC_A0) AM3359.R14(GPMC_A4) AM3359.T6(GPMC_BEN0_CLE) AM3359.T7(GPMC_OEN_REN) AM3359.T8(GPMC_AD3) AM3359.T9(GPMC_AD7) AM3359.T13(GPMC_CSN3) AM3359.T14(GPMC_A3) AM3359.T15(GPMC_A7) AM3359.T17(GPMC_WAIT0) AM3359.U6(GPMC_WEN) AM3359.U7(GPMC_AD0) AM3359.U8(GPMC_AD4) AM3359.U9(GPMC_CSN1) AM3359.U14(GPMC_A2) AM3359.U15(GPMC_A6) AM3359.U16(GPMC_A9) AM3359.U17(GPMC_WPN) AM3359.U18(GPMC_BEN1) AM3359.V6(GPMC_CSN0) AM3359.V7(GPMC_AD1) AM3359.V8(GPMC_AD5) AM3359.V9(GPMC_CSN2) AM3359.V14(GPMC_A1) AM3359.V15(GPMC_A5) AM3359.V16(GPMC_A8) AM3359.V17(GPMC_A11) P1.3 S1.3 U2.A2(NC) U2.E2(NC) U2.R3(RFU) U2.R7(RFU) U3.7(WP) U4.4(BAT) U4.5(BAT) U4.6(BAT_SENSE) U4.11(TS) U4.12(USB) U4.15(NC) U4.17(NC) U4.25(PB_IN) U4.44(NRESET) U5.3(FLAG) U6.3(2Y) U6.5(2A) U6.6(2B) U7.11(GND3) U7.12(GND4) U7.13(GND5) U7.14(GND6) U7.15(GND7) U7.16(GND8) U8.7(T2_OUT) U8.8(R2_IN) U8.9(R2_OUT) U8.10(T2_IN) U9.5(SHIELD) U9.6(SHIELD) U11.3(ID) U11.5(NC) U13.3(ID) U13.5(NC) U14.5(SHIELD) U14.6(SHIELD) Y1.3 Y1.4 Y2.2 Y2.4

## Notes on the sheet
- AM3359 Processor
- Power Management
- FIlters
- 1.8V@100mA
- Boot Configuration
- SYS_BOOT_0
- SYS_BOOT_1
- SYS_BOOT_2
- SYS_BOOT_3
- SYS_BOOT_4
- SYS_BOOT_5
- SYS_BOOT_6
- SYS_BOOT_7
- SYS_BOOT_8
- SYS_BOOT_9
- SYS_BOOT_10
- SYS_BOOT_11
- SYS_BOOT_12
- SYS_BOOT_13
- SYS_BOOT_14
- SYS_BOOT_15
- USB Host Connector 1
- Uart_to_RS232
- USB Host Connector 0
- Reset Button
- ROM Memory
- Circuit Name: AM3359 Board v1.12
- Designer: Konstantinos Tsimpoukas
- Memory RAM
- SD card Connector
- Date: 16-7-2012

## Library data of the parts
AM3359 = beaglebone_components:AM335X: The AM335x microprocessors, based on the ARM Cortex-A8, are enhanced with image, graphics processing, peripherals and industrial interface options such as EtherCAT and PROFIBUS.
BL_IN BL_ISET1 BL_ISET2 BL_ISINK1 BL_ISINK2 BL_OUT GND0 GND1-GND3 I2C2_SCL I2C2_SDA LCD0 LCD1-LCD23 LCD_AC_BIAS_EN LCD_HSYNC LCD_MEM_CLK LCD_PCLK LCD_VSYNC SYS_5V VDD_3V3A VDD_3V3B VDD_5V = SparkFun:M01: Header 1 Standard 1-pin 0.1" header. Use with straight break away headers (SKU : PRT-00116), right angle break away headers (PRT-00553), swiss pins (PRT-00743), machine pins (PRT-00117), and female headers (PRT-00115).
C1-C116 C118 C120 C121 = SparkFun:CAP: Capacitor Standard 0603 ceramic capacitor, and 0.1" leaded capacitor.
C117 C119 = beaglebone_components:B45196H1107M309: B45196H1107M309 KEMET CAPACITOR CAP_TANT_100UF_6.3V_3528-21
FB1-FB3 = beaglebone_components:LI0805H151R-10: Ferrite Low Current Chip Beads (<1,000 mA, <400 W Z) LI0805H151R-10
JP1 = SparkFun:M03: Header 3 Standard 3-pin 0.1" header. Use with straight break away headers (SKU : PRT-00116), right angle break away headers (PRT-00553), swiss pins (PRT-00743), machine pins (PRT-00117), and female headers (PRT-00115). Molex polarized connector foot print use with SKU : PRT-08232 with associated crimp pins and housings.
L1 L2 = beaglebone_components:VLCF5020T-2R2N2R6-3: TDK VLCF5020T-2R2N2R6-3 Inductor 2.2uH smt 2.6A, 58 milliohm
L3 = beaglebone_components:ELL-5PR2R2N: Panasonic-ECG ELL-5PR2R2N COIL CHOKE 2.2UH SHIELDED SMD
LED1 = led:LED: LED OSRAM: - CHIPLED LG R971, LG N971, LY N971, LG Q971, LY Q971, LO R971, LY R971 LH N974, LH R974 LS Q976, LO Q976, LY Q976 LO Q996 - Hyper CHIPLED LW Q18S LB Q993, LB Q99A, LB R99A - SideLED LS A670, LO A670, LY A670, LG A670, LP A670 LB A673, LV A673, LT A673, LW A673 LH A674 LY A675 LS A676, LA A676, LO A676, LY A676, LW A676 LS A679, LY A679, LG A679 - Hyper Micro SIDELED® LS Y876, LA Y876, LO Y876, LY Y876 LT Y87S - SmartLED LW L88C, LW L88S LB L89C, LB L89S, LG L890 LS L89K, LO L89K, LY L89K LS L896, LA L896, LO L896, LY L896 - TOPLED LS T670, LO T670, LY T670, LG T670, LP T670 LSG T670, LSP T670, LSY T670, LOP T670, LYG T670 LG T671, LOG T671, LSG T671 LB T673, LV T673, LT T673, LW T673 LH T674 LS T676, LA T676, LO T676, LY T676, LB T676, LH T676, LSB T676, LW T676 LB T67C, LV T67C, LT T67C, LS T67K, LO T67K, LY T67K, LW E67C LS E67B, LA E67B, LO E67B, LY E67B, LB E67C, LV E67C, LT E67C LW T67C LS T679, LY T679, LG T679 LS T770, LO T770, LY T770, LG T770, LP T770 LB T773, LV T773, LT T773, LW T773 LH T774 LS E675, LA E675, LY E675, LS T675 LS T776, LA T776, LO T776, LY T776, LB T776 LHGB T686 LT T68C, LB T68C - Hyper Mini TOPLED® LB M676 - Mini TOPLED Santana® LG M470 LS M47K, LO M47K, LY M47K Source: http://www.osram.convergy.de LUXEON: - LUMILED® LXK2-PW12-R00, LXK2-PW12-S00, LXK2-PW14-U00, LXK2-PW14-V00 LXK2-PM12-R00, LXK2-PM12-S00, LXK2-PM14-U00 LXK2-PE12-Q00, LXK2-PE12-R00, LXK2-PE12-S00, LXK2-PE14-T00, LXK2-PE14-U00 LXK2-PB12-K00, LXK2-PB12-L00, LXK2-PB12-M00, LXK2-PB14-N00, LXK2-PB14-P00, LXK2-PB14-Q00 LXK2-PR12-L00, LXK2-PR12-M00, LXK2-PR14-Q00, LXK2-PR14-R00 LXK2-PD12-Q00, LXK2-PD12-R00, LXK2-PD12-S00 LXK2-PH12-R00, LXK2-PH12-S00 LXK2-PL12-P00, LXK2-PL12-Q00, LXK2-PL12-R00 Source: www.luxeon.com KINGBRIGHT: KA-3528ASYC Source: www.kingbright.com
P1 = beaglebone_components:PJ-002A: JACK POWER CONNECTOR PJ-002A
R1-R103 R105-R110 = SparkFun:RESISTOR: Resistor Basic schematic elements and footprints for 0603, 1206, and PTH resistors.
R104 = beaglebone_components:WSC452750R00FEA: RESISTOR Wirewound Resistors - SMD 2watts 50ohms 1% WSC452750R00FEA
S1 = beaglebone_components:B3U-1100P: RESET BUTTON B3U-1100P
U2 = beaglebone_components:MT47H128M16RT-25E:C: MICRON DDR2 SDRAM 128 MB MT47H128M16 ? 16 Meg x 16 x 8 banks
U3 = beaglebone_components:CAT24C256WI-G: On Semiconductor 25 kb I2C CMOS Serial EEPROM
U4 = beaglebone_components:TPS65217BRSLT: SINGLE-CHIP PMIC FOR BATTERY-POWERED SYSTEMS
U5 = beaglebone_components:NCP349MNAETBG: ON SEMICONDUCTOR Positive Overvoltage Protection Controller with Interenal Low Ron Nmos Fet
U6 = beaglebone_components:SN74LVC2G00DCUR: SN74LVC2G00DCUR DUAL 2-INPUT POSITIVE-NAND GATE
U7 = beaglebone_components:SCHA5B0200: MicroSD card connector SCHA5B0200
U8 = beaglebone_components:ADM3202ARUZ: IC TX/RX DUALRS-232 3.3V 16 TSSOP 16 PACKAGE ADM3202ARUZ
U9 U14 = beaglebone_components:USB_87520_0010BLF: 87520-0010BLF USB CONNECTOR
U10 U12 = beaglebone_components:TPS2051BDGN: TPS2051BDGN TEXAS INSTRUMENTS POWER DISTRIBUTION SWITCHES
U11 U13 = beaglebone_components:TPD4S012DRYR: TPD4S012DRYR 4 CHANNEL ESD SOLUTION FOR USB HOST
Y1 = beaglebone_components:MC-306_32.7680K-.A: Epson Toyocom Crystals Crystal 32.768KHz
Y2 = beaglebone_components:CS325-24.000MABJ-UT: Citizen Micro HumanTech CS325 CRYSTAL 24.0000MHZ 18PF SMD

## Net classes
0 DATA: width 0.125 mm, drill 0.203 mm, clearance 0.125 mm
1 GND: width 0.203 mm, drill 0.203 mm, clearance 0.125 mm to class 0, clearance 0.125 mm
2 +5V: width 0.203 mm, drill 0.203 mm, clearance 0.125 mm to class 0, clearance 0.125 mm to class 1, clearance 0.125 mm
3 +3.3V: width 0.203 mm, drill 0.203 mm, clearance 0.125 mm to class 0, clearance 0.125 mm to class 1, clearance 0.125 mm to class 2, clearance 0.125 mm
4 +1.8V: width 0.203 mm, drill 0.203 mm, clearance 0.125 mm to class 0, clearance 0.125 mm to class 1, clearance 0.125 mm to class 2, clearance 0.125 mm to class 3, clearance 0.125 mm
5 +1.1V: width 0.203 mm, drill 0.203 mm, clearance 0.125 mm to class 0, clearance 0.125 mm to class 1, clearance 0.125 mm to class 2, clearance 0.125 mm to class 3, clearance 0.125 mm to class 4, clearance 0.125 mm
6 +1.3V: width 0.203 mm, drill 0.203 mm, clearance 0.125 mm to class 0, clearance 0.125 mm to class 1, clearance 0.125 mm to class 2, clearance 0.125 mm to class 3, clearance 0.125 mm to class 4, clearance 0.125 mm to class 5, clearance 0.125 mm